# EasyEDA Pro project 天猛星转LITO.eprj

# Schematic Schematic1
Board Name: Board1; Create Date: 2025-07-26; Page Name: P1; Project Name: 天猛星转LITO; Schematic Name: Schematic1; Update Date: 2025-07-26; Company: 嘉立创EDA; Page Size: A4; Version: V1.0
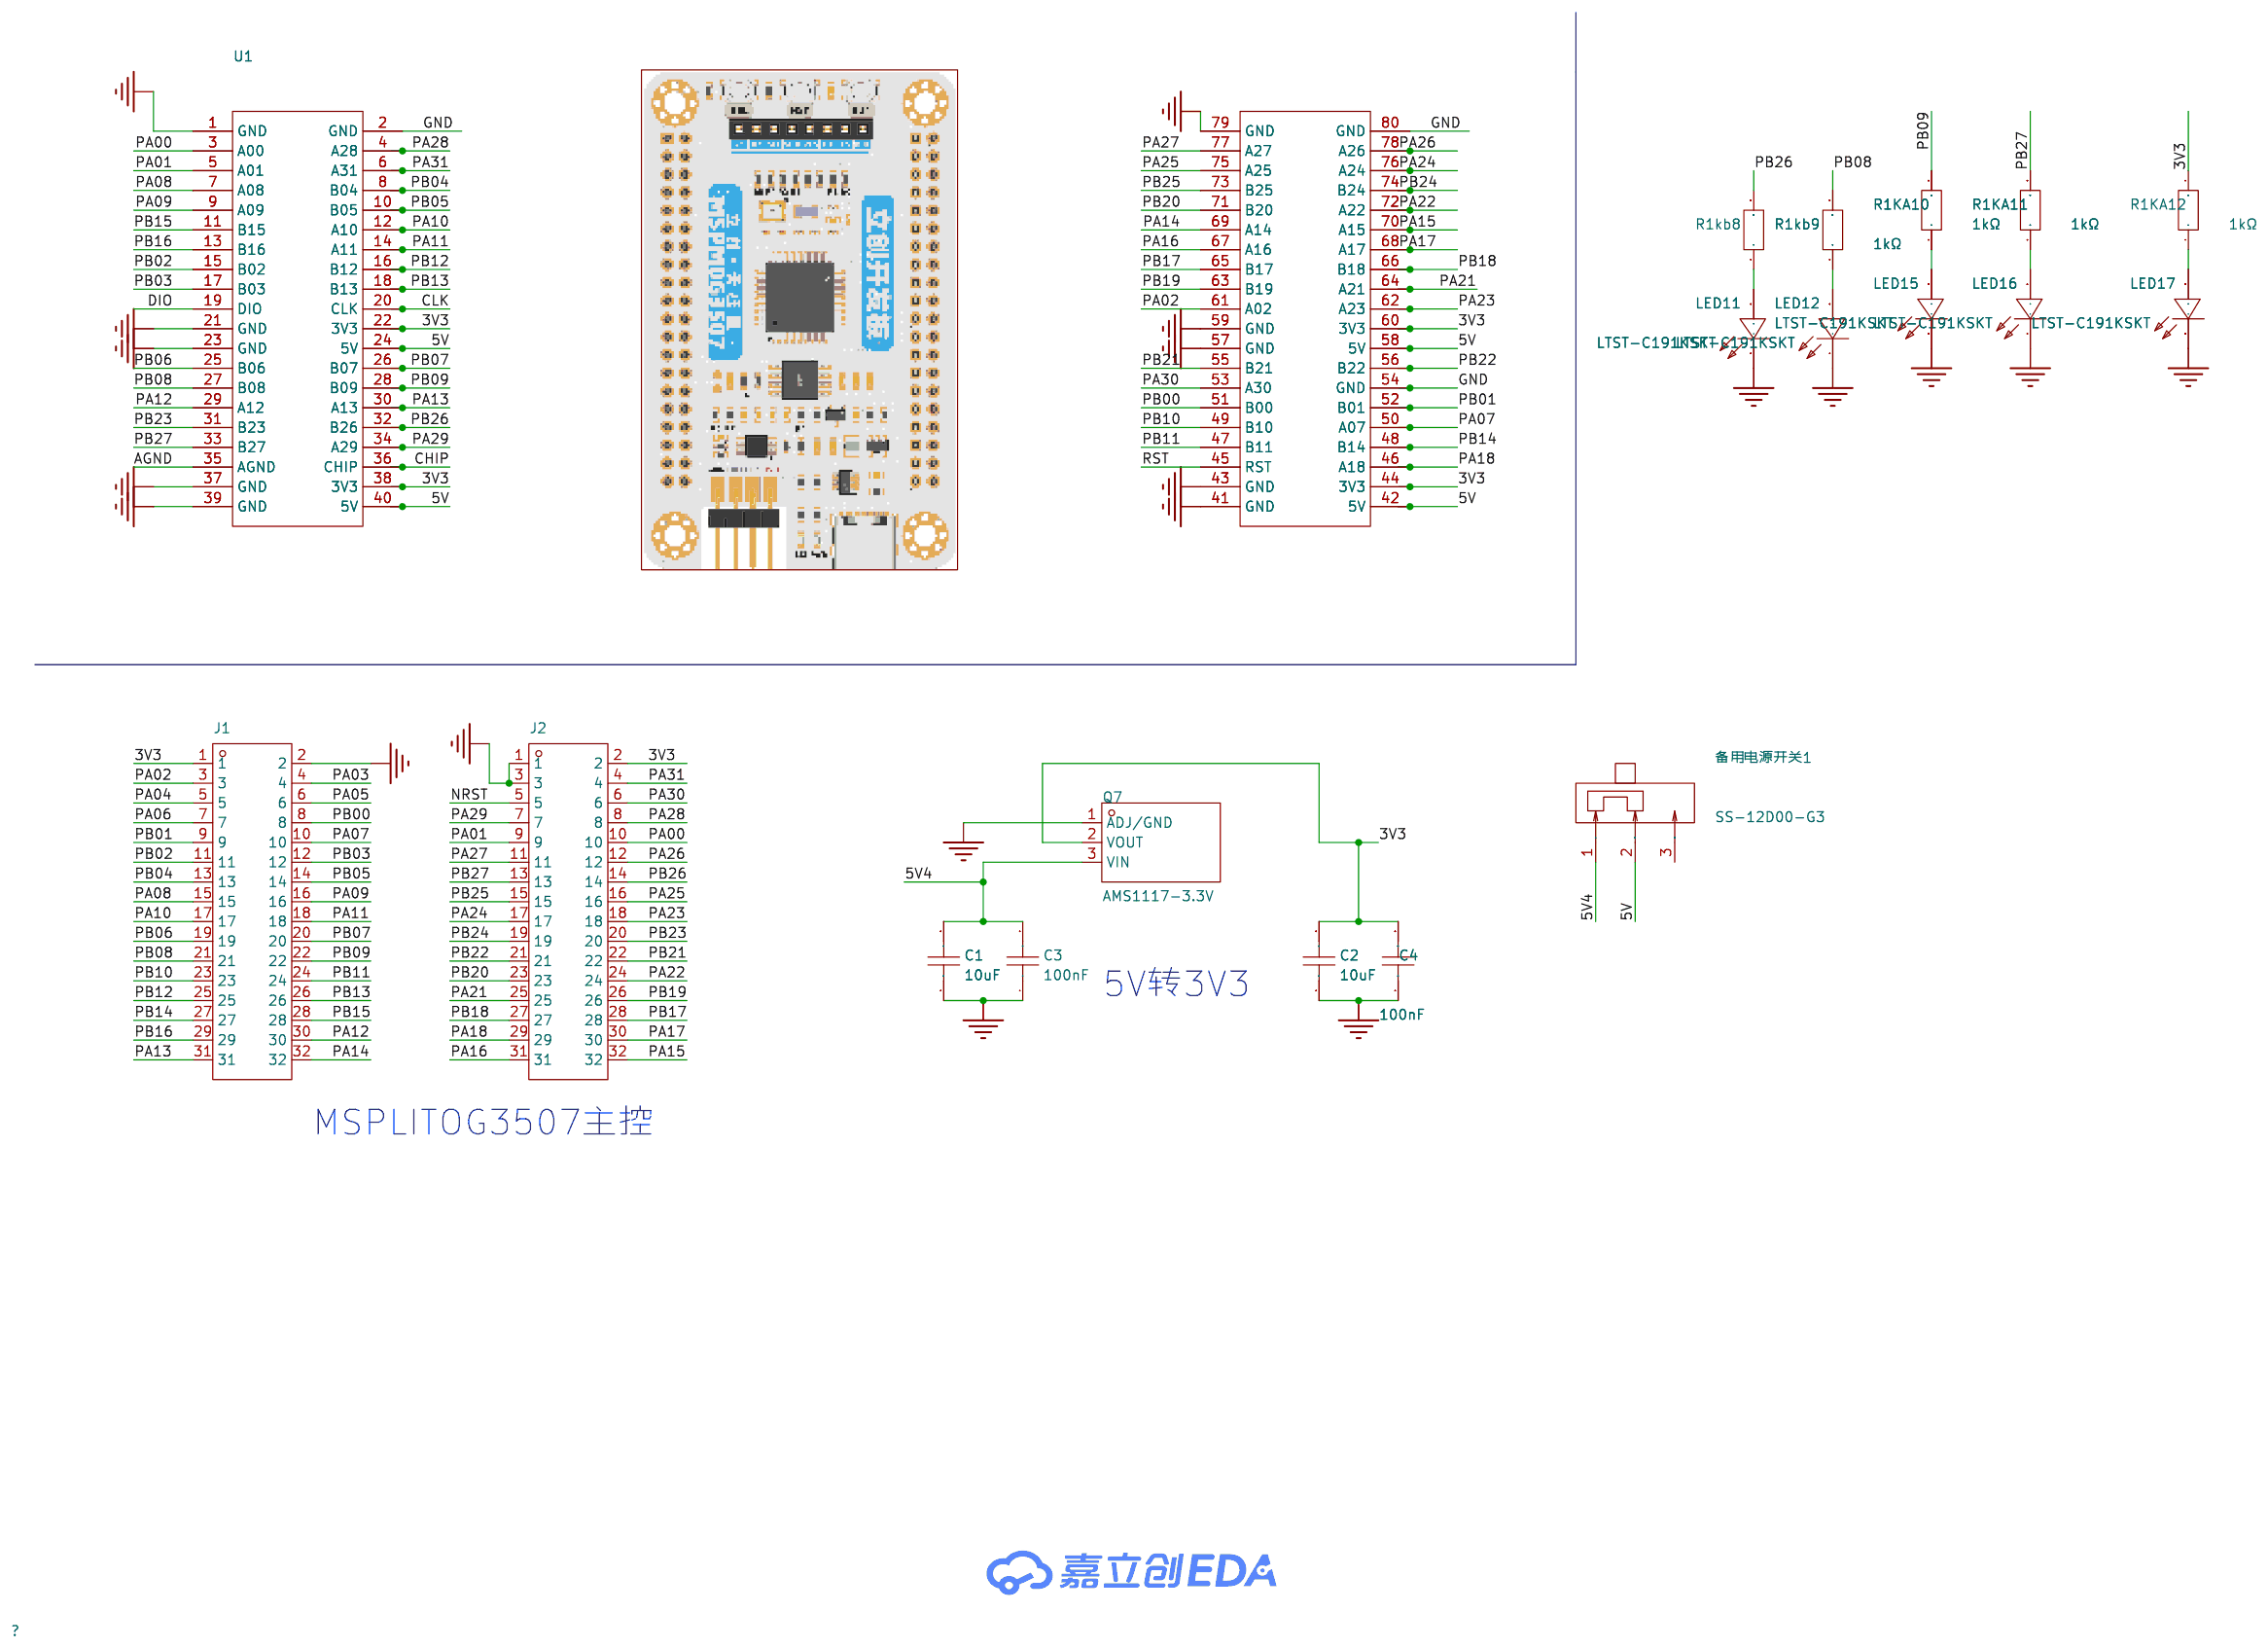
[diagram p0: schematic sheet]

## Parts
C1  10uF  [C0805]
C2  10uF  [C0805]
C3  100nF  [C0603]
C4  100nF  [C0603]
J1  X6521FV-2x16-C85D32  [HDR-TH_32P-P2.54-V-F-R2-C16-S2.54]
J2  X6521FV-2x16-C85D32  [HDR-TH_32P-P2.54-V-F-R2-C16-S2.54]
LED11  LTST-C191KSKT  [LED0603-RD-YELLOW]
LED12  LTST-C191KSKT  [LED0603-RD-YELLOW]
LED15  LTST-C191KSKT  [LED0603-RD-YELLOW]
LED16  LTST-C191KSKT  [LED0603-RD-YELLOW]
LED17  LTST-C191KSKT  [LED0603-RD-YELLOW]
Q7  AMS1117-3.3V  [SOT-89-3_L4.5-W2.5-P1.50-LS4.2-BR]
R1KA10  1kΩ  [R0603]
R1KA11  1kΩ  [R0603]
R1KA12  1kΩ  [R0603]
R1kb8  1kΩ  [R0603]
R1kb9  1kΩ  [R0603]
U1  LCKFB-TMX-MSPM0G3507  [COMM-TH_LCKFB-TMX-MSPM0G3507]
备用电源开关1  SS-12D00-G3  [SW-TH_3P-L8.8-W3.9-P2.50_SS12D00G3]

## Library data of the parts
C1 C2 = CGA0805X5R106K250MT: 容值:10uF;精度:±10%;额定电压:25V;温度系数:X5R;; LCSC Part Name: 10uF ±10% 25V; Supplier Part: C6119887; Manufacturer: HRE(芯声); Supplier Footprint: 0805; JLCPCB Part Class: 扩展库; Supplier: LCSC; Tolerance: ±10%; Voltage Rating: 25V; Temperature Coefficient: X5R
C3 C4 = CGA0603X7R104K500JT: 容值:100nF;精度:±10%;额定电压:50V;温度系数:X7R;; LCSC Part Name: 100nF ±10% 50V; Supplier Part: C6119867; Manufacturer: HRE(芯声); Supplier Footprint: 0603; JLCPCB Part Class: 扩展库; Datasheet: https://atta.szlcsc.com/upload/public/pdf/source/20250103/C44077DA9E7B3EFAE02F22B6D3D1CBC9.pdf; Supplier: LCSC; Tolerance: ±10%; Voltage Rating: 50V; Temperature Coefficient: X7R
J1 J2 = X6521FV-2x16-C85D32: 插孔结构:2x16P;间距:2.54mm;行距:2.54mm;圆孔/方孔:方孔;安装类型:直插;排数:双排;总孔位数:32P;额定电流:3A;额定电压:250V;插孔方向:顶部;塑高:8.5mm;触头材质:黄铜;触头镀层:金;工作温度范围:-40℃~+105℃;焊接温度(最大值):260℃;; LCSC Part Name: 间距:2.54mm 2x16P 直插; Supplier Part: C2883989; Manufacturer: XKB Connection(中国星坤); Supplier Footprint: 插件,P=2.54mm; JLCPCB Part Class: 扩展库; Datasheet: https://atta.szlcsc.com/upload/public/pdf/source/20211009/C636DBF0733662F7F428F4420CCBBD46.pdf; Supplier: LCSC; Holes Structure: 2x16P; Pitch: 2.54mm; Row Spacing: 2.54mm; Circular Hole / Square Hole: 方孔; Mounting Type: 直插; Number of Rows: 双排; Number of Holes: 32P; Current Rating (Max): 3A; Voltage Rating (Max): 250V; Holes Direction: 顶部; Insulation Height: 8.5mm; Contact Material: 黄铜; Contact Plating: 金; Operating Temperature Range: -40℃~+105℃; Soldering Temperature(Max): 260℃
LED11 LED12 LED15-LED17 = LTST-C191KSKT: 发光颜色:黄色;正向电压(VF):2.1V;功率:75mW;正向电流:20mA;主波长:584.5nm~597nm;二极管配置:-;透镜颜色:无色透明透镜;色温:-;发光强度:104mcd;发光角度:130°;载带方式:-;工作温度:-55℃~+85℃;; LCSC Part Name: 黄灯; Supplier Part: C125100; Manufacturer: LITEON(光宝); Supplier Footprint: 0603; JLCPCB Part Class: 扩展库; Datasheet: https://atta.szlcsc.com/upload/public/pdf/source/20180129/C125100_15171877314981315871.pdf; Supplier: LCSC; Emitted Color: 黄色; Forward Voltage (VF): 2.1V; Power Dissipation: 75mW; Forward Current: 20mA; Dominant Wavelength: 584.5nm~597nm; Peak Wavelength: 588nm; Lens Color: 无色透明透镜; Luminous Intensity: 104mcd; Viewing Angle: 130°; Operating Temperature: -55℃~+85℃
Q7 = AMS1117-3.3V_C5120796: 输出类型:固定;工作电压:18V;输出电压:3.3V;输出电流:1A;输出极性:正极;; LCSC Part Name: 输入18V 输出3.3V 1A; Supplier Part: C5120796; Manufacturer: MSKSEMI(美森科); Supplier Footprint: SOT-89; JLCPCB Part Class: 扩展库; Datasheet: https://atta.szlcsc.com/upload/public/pdf/source/20240731/7960C38D2F7D4AC8FF3CFA386029A4C5.pdf; Supplier: LCSC; Output Type: 固定; Voltage - Supply: 18V; Output Voltage: 3.3V; Output Current: 1A; Voltage Dropout: 1.4V@(1A); standby current: 12mA; Operating Temperature: 0℃~+125℃; Output Configuration: 正极; Number of Outputs: 1
R1KA10-R1KA12 R1kb8 R1kb9 = FCR0603F1K: 电阻类型:厚膜电阻;阻值:1kΩ;精度:±1%;功率:100mW;最大工作电压:75V;; LCSC Part Name: 1K ±1%; Supplier Part: C5913168; Manufacturer: VO(翔胜); Supplier Footprint: 0603; JLCPCB Part Class: 扩展库; Datasheet: https://atta.szlcsc.com/upload/public/pdf/source/20230428/98B65D379E9BA4CF2A9223D1647B01B6.pdf; Supplier: LCSC; Type: 厚膜电阻; Tolerance: ±1%; Power(Watts): 100mW; Overload Voltage (Max): 75V; Operating Temperature Range: -55℃~+155℃
U1 = LCKFB-TMX-MSPM0G3507: LCSC Part Name: 5件套 立创·天猛星MSPM0G3507开发板; Supplier Part: C42378531; Manufacturer: 立创开发板; Datasheet: https://atta.szlcsc.com/upload/public/pdf/source/20241209/800332349277522348D9357AB5109808.pdf; Supplier: LCSC
备用电源开关1 = SS-12D00-G3: 操作正拨 插件立式 尺寸大型 两档位; Supplier Part: C22355741; Manufacturer: SOFNG(硕方); Supplier Footprint: 插件-3P,8.8x3.9mm; JLCPCB Part Class: 扩展库; Datasheet: https://atta.szlcsc.com/upload/public/pdf/source/20240529/1037A069FE9BBCECE56007AB916D4384.pdf; Supplier: LCSC

## Nets
3V3: C2.2 C4.2 J1.1 J2.2 Q7.2(VOUT) R1KA12.2 U1.22(3V3) U1.38(3V3) U1.44(3V3) U1.60(3V3)
5V: U1.24(5V) U1.40(5V) U1.42(5V) U1.58(5V) 备用电源开关1.2
5V4: C1.2 C3.2 Q7.3(VIN) 备用电源开关1.1
AGND: U1.35(AGND)
GND: C1.1 C2.1 C3.1 C4.1 J1.2 J2.1 J2.3 LED11.1(-) LED12.1(-) LED15.1(-) LED16.1(-) LED17.1(-) Q7.1(ADJ/GND) U1.1(GND) U1.2(GND) U1.21(GND) U1.23(GND) U1.37(GND) U1.39(GND) U1.41(GND) U1.43(GND) U1.54(GND) U1.57(GND) U1.59(GND) U1.79(GND) U1.80(GND)
CHIP: U1.36(CHIP)
CLK: U1.20(CLK)
DIO: U1.19(DIO)
NRST: J2.5
PA00: J2.10 U1.3(A00)
PA01: J2.9 U1.5(A01)
PA02: J1.3 U1.61(A02)
PA03: J1.4
PA04: J1.5
PA05: J1.6
PA06: J1.7
PA07: J1.10 U1.50(A07)
PA08: J1.15 U1.7(A08)
PA09: J1.16 U1.9(A09)
PA10: J1.17 U1.12(A10)
PA11: J1.18 U1.14(A11)
PA12: J1.30 U1.29(A12)
PA13: J1.31 U1.30(A13)
PA14: J1.32 U1.69(A14)
PA15: J2.32 U1.70(A15)
PA16: J2.31 U1.67(A16)
PA17: J2.30 U1.68(A17)
PA18: J2.29 U1.46(A18)
PA21: J2.25 U1.64(A21)
PA22: J2.24 U1.72(A22)
PA23: J2.18 U1.62(A23)
PA24: J2.17 U1.76(A24)
PA25: J2.16 U1.75(A25)
PA26: J2.12 U1.78(A26)
PA27: J2.11 U1.77(A27)
PA28: J2.8 U1.4(A28)
PA29: J2.7 U1.34(A29)
PA30: J2.6 U1.53(A30)
PA31: J2.4 U1.6(A31)
PB00: J1.8 U1.51(B00)
PB01: J1.9 U1.52(B01)
PB02: J1.11 U1.15(B02)
PB03: J1.12 U1.17(B03)
PB04: J1.13 U1.8(B04)
PB05: J1.14 U1.10(B05)
PB06: J1.19 U1.25(B06)
PB07: J1.20 U1.26(B07)
PB08: J1.21 R1kb9.2 U1.27(B08)
PB09: J1.22 R1KA10.2 U1.28(B09)
PB10: J1.23 U1.49(B10)
PB11: J1.24 U1.47(B11)
PB12: J1.25 U1.16(B12)
PB13: J1.26 U1.18(B13)
PB14: J1.27 U1.48(B14)
PB15: J1.28 U1.11(B15)
PB16: J1.29 U1.13(B16)
PB17: J2.28 U1.65(B17)
PB18: J2.27 U1.66(B18)
PB19: J2.26 U1.63(B19)
PB20: J2.23 U1.71(B20)
PB21: J2.22 U1.55(B21)
PB22: J2.21 U1.56(B22)
PB23: J2.20 U1.31(B23)
PB24: J2.19 U1.74(B24)
PB25: J2.15 U1.73(B25)
PB26: J2.14 R1kb8.2 U1.32(B26)
PB27: J2.13 R1KA11.2 U1.33(B27)
RST: U1.45(RST)
$1N2178: LED17.2(+) R1KA12.1
Net-(LED11-2): LED11.2(+) R1kb8.1
Net-(LED12-2): LED12.2(+) R1kb9.1
Net-(LED15-2): LED15.2(+) R1KA10.1
Net-(LED16-2): LED16.2(+) R1KA11.1

Not connected (* = marked no-connect by the designer): 备用电源开关1 3

## Notes on the sheet
- 5V转3V3
- MSPLITOG3507主控

# Board PCB1
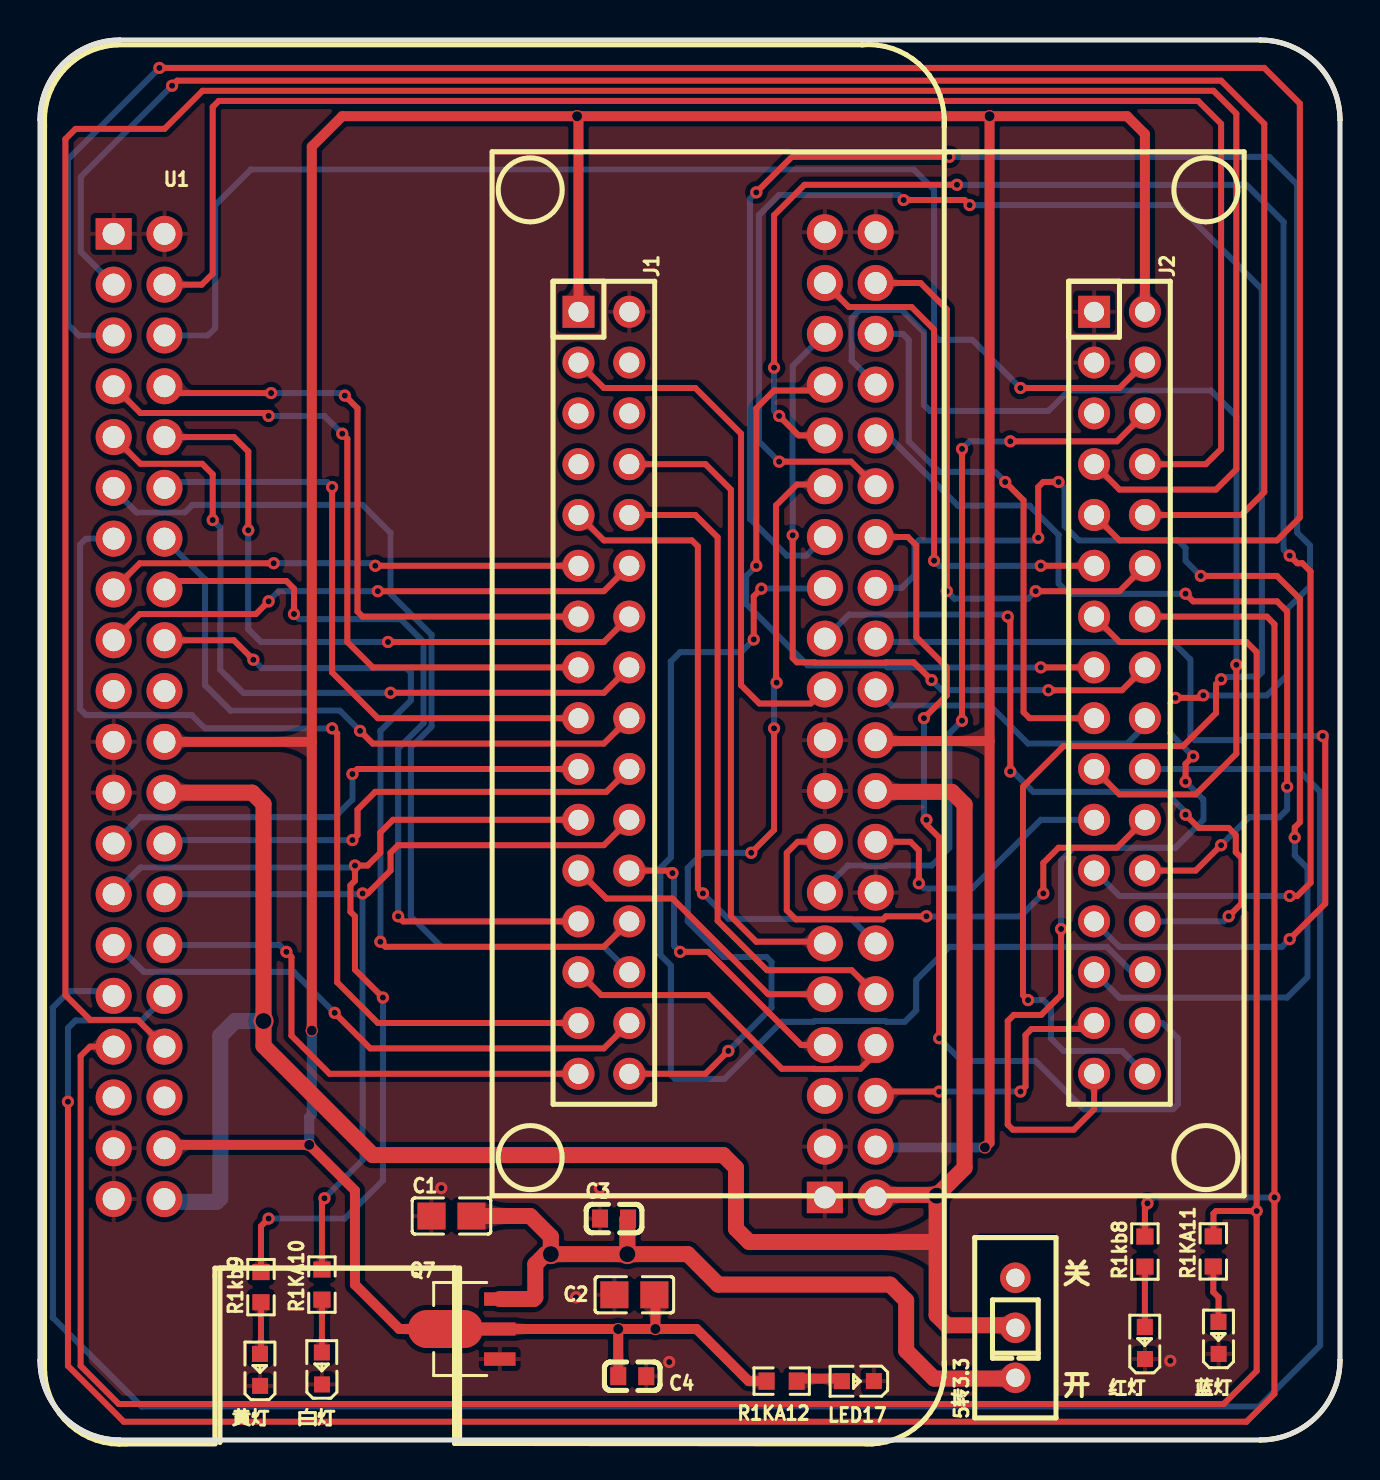
[diagram p1: board, top side]
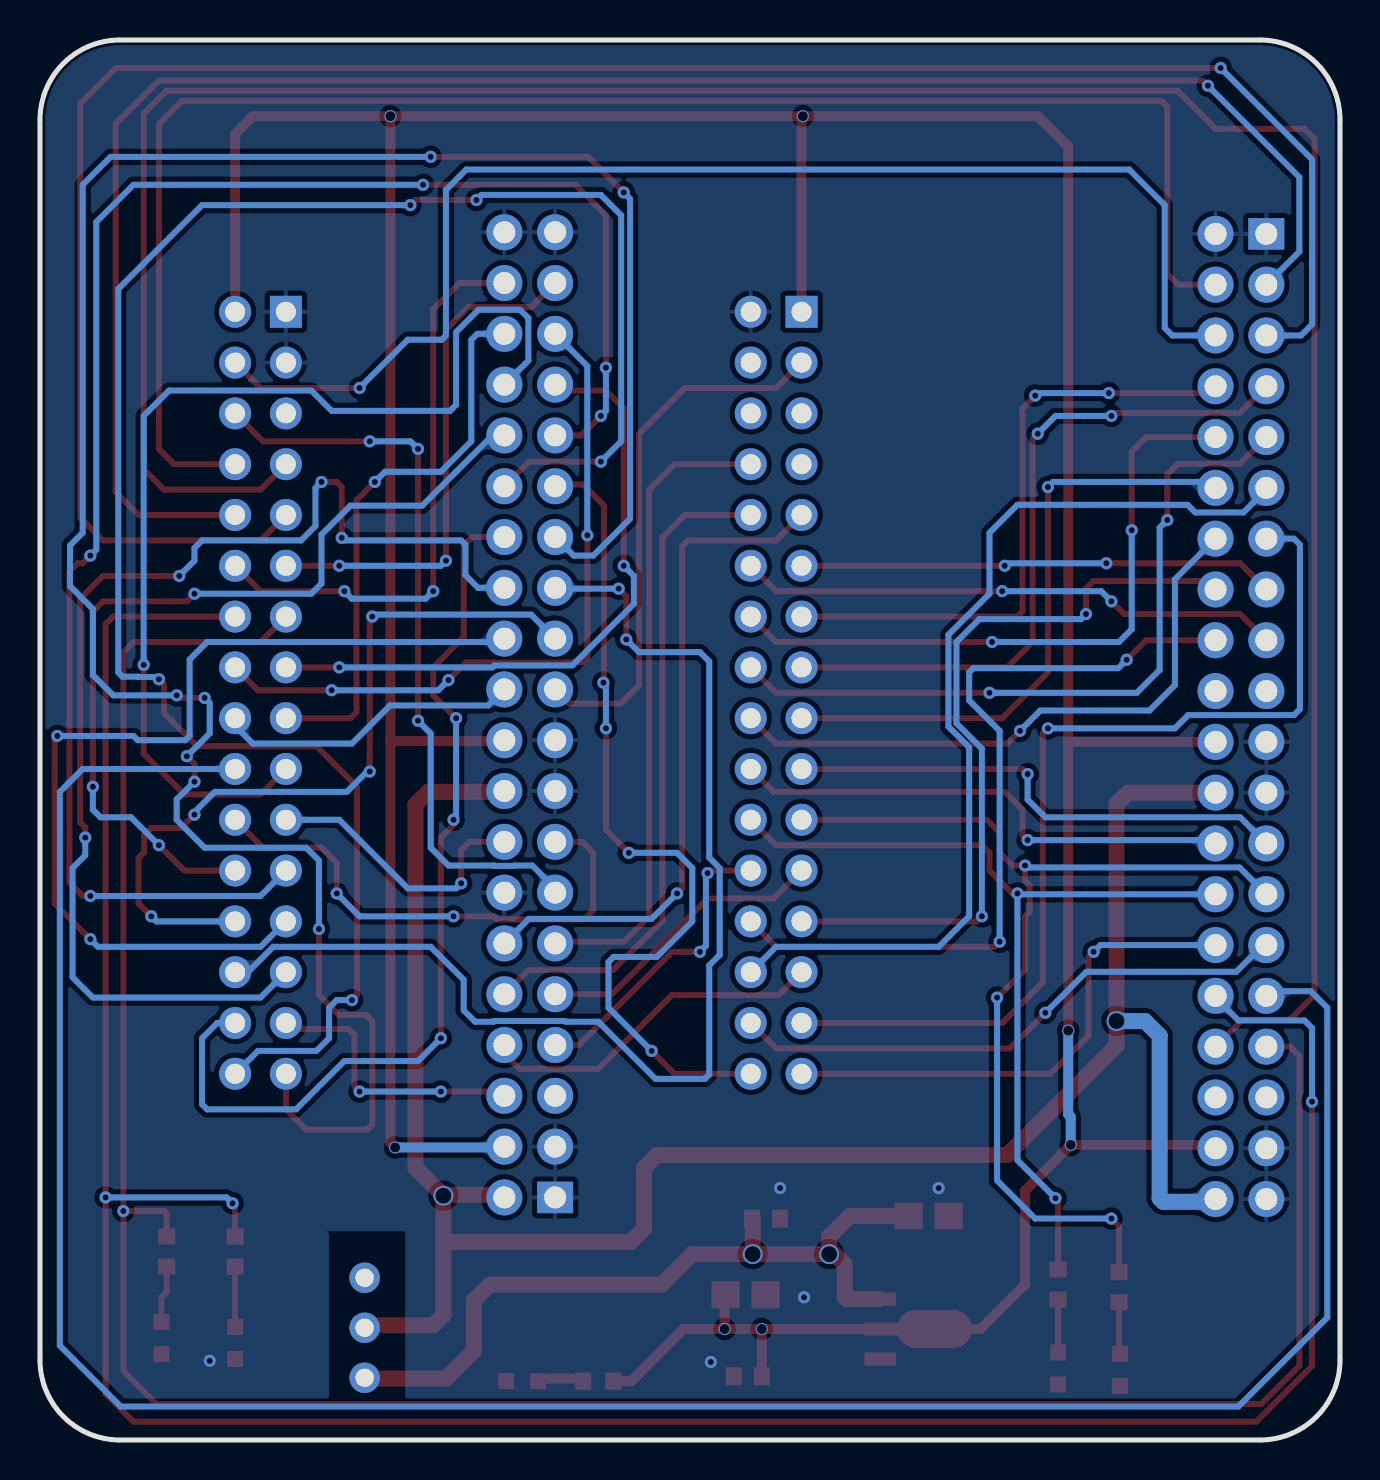
[diagram p2: board, bottom side, seen from below]

Outline 65 x 70 mm; copper layers: Top Layer, Inner1, Inner2, Bottom Layer. Coordinates in mm from the lower left corner of the outline.
Outline path: 0,66 0,4 arc(1.17,1.17) 4,0 61,0 arc(63.83,1.17) 65,4 65,66 arc(63.83,68.83) 61,70 4,70 arc(1.17,68.83) 0,66
Stack: Top Layer 0.035mm 外层铜厚1oz / Dielectric1 0.2104mm 7628 RC49% 8.6mil / Inner1 0.0152mm 内层铜厚 / Dielectric2 1.065mm 1.1mm H/HOZ Copper / Inner2 0.0152mm 内层铜厚 / Dielectric3 0.2104mm 7628 RC49% 8.6mil / Bottom Layer 0.035mm 外层铜厚1oz

## Design rules (mm)
template: 自定义配置
spacing copperThickness1oz (default): track to track 0.102, other pairs 0.152 to 0.3
spacing copperThickness2oz: track to track 0.203, other pairs 0.152 to 0.3
track width copperThickness1oz (default): min 0.3, default 0.3, max 2.54
track width copperThickness2oz: min 0.203, default 0.254, max 2.54
differential pair differentialPair (default): width min 0.127, default 0.254, max 2.54; gap min 0.152, default 0.152
via viaSize (default): diameter min 0.5, default 0.61, max 10; hole min 0.3, default 0.305, max 6.3

## Placement (name value [footprint] x y rotation side)
5转3.3  SS-12D00-G3  [SW-TH_3P-L8.8-W3.9-P2.50_SS12D00G3]  48.77 5.61 90 top
C1  10uF  [C0805]  20.57 11.2 0 top
C2  10uF  [C0805]  29.72 7.26 0 top
C3  100nF  [C0603]  28.7 11.07 0 top
C4  100nF  [C0603]  29.61 3.19 180 top
J1  X6521FV-2x16-C85D32  [HDR-TH_32P-P2.54-V-F-R2-C16-S2.54]  28.19 37.36 270 top
J2  X6521FV-2x16-C85D32  [HDR-TH_32P-P2.54-V-F-R2-C16-S2.54]  53.97 37.36 270 top
LED17  LTST-C191KSKT  [LED0603-RD-YELLOW]  40.89 2.94 180 top
Q7  AMS1117-3.3V  [SOT-89-3_L4.5-W2.5-P1.50-LS4.2-BR]  21.63 5.55 0 top
R1KA10  1kΩ  [R0603]  14.1 7.77 90 top
R1KA11  1kΩ  [R0603]  58.67 9.43 90 top
R1KA12  1kΩ  [R0603]  37.08 2.94 180 top
R1kb8  1kΩ  [R0603]  55.25 9.42 90 top
R1kb9  1kΩ  [R0603]  11.05 7.64 90 top
U1  LCKFB-TMX-MSPM0G3507  [COMM-TH_LCKFB-TMX-MSPM0G3507]  22.73 36.22 0 top
白灯  LTST-C191KSKT  [LED0603-RD-YELLOW]  14.1 3.58 90 top
红灯  LTST-C191KSKT  [LED0603-RD-YELLOW]  55.25 4.85 90 top
蓝灯  LTST-C191KSKT  [LED0603-RD-YELLOW]  58.93 5.1 90 top
黄灯  LTST-C191KSKT  [LED0603-RD-YELLOW]  11 3.5 90 top

## Footprints (pads in the part's own frame, mm; a bottom-side part is the same pattern mirrored in y, then rotated)
C0603
  rect 0.8x0.9 smd: 1(-0.7,0) 2(0.7,0)
C0805
  rect 1.41x1.35 smd: 1(-1,0) 2(1,0)
COMM-TH_LCKFB-TMX-MSPM0G3507
  rect 1.8x1.575 hole 1.1: 1(-19.05,24.09) 41(16.51,-24.09)
  round 1.8 hole 1.1: 2(-16.51,24.09) 3(-19.05,21.549) 4(-16.51,21.549) 5(-19.05,19.009) 6(-16.51,19.009) 7(-19.05,16.47) 8(-16.51,16.47) 9(-19.05,13.93) 10(-16.51,13.93) 11(-19.05,11.389) 12(-16.51,11.389) 13(-19.05,8.85) 14(-16.51,8.85) 15(-19.05,6.309) 16(-16.51,6.309) 17(-19.05,3.769) 18(-16.51,3.769) 19(-19.05,1.23) 20(-16.51,1.23) 21(-19.05,-1.31) 22(-16.51,-1.31) 23(-19.05,-3.85) 24(-16.51,-3.85) 25(-19.05,-6.391) 26(-16.51,-6.391) 27(-19.05,-8.931) 28(-16.51,-8.931) 29(-19.05,-11.47) 30(-16.51,-11.47) 31(-19.05,-14.011) 32(-16.51,-14.011) 33(-19.05,-16.55) 34(-16.51,-16.55) 35(-19.05,-19.09) 36(-16.51,-19.09) 37(-19.05,-21.631) 38(-16.51,-21.631) 39(-19.05,-24.171) 40(-16.51,-24.171) 42(19.05,-24.09) 43(16.51,-21.549) 44(19.05,-21.549) 45(16.51,-19.009) 46(19.05,-19.009) 47(16.51,-16.47) 48(19.05,-16.47) 49(16.51,-13.93) 50(19.05,-13.93) 51(16.51,-11.389) 52(19.05,-11.389) 53(16.51,-8.85) 54(19.05,-8.85) 55(16.51,-6.309) 56(19.05,-6.309) 57(16.51,-3.769) 58(19.05,-3.769) 59(16.51,-1.23) 60(19.05,-1.23) 61(16.51,1.31) 62(19.05,1.31) 63(16.51,3.85) 64(19.05,3.85) 65(16.51,6.391) 66(19.05,6.391) 67(16.51,8.931) 68(19.05,8.931) 69(16.51,11.47) 70(19.05,11.47) 71(16.51,14.011) 72(19.05,14.011) 73(16.51,16.55) 74(19.05,16.55) 75(16.51,19.09) 76(19.05,19.09) 77(16.51,21.631) 78(19.05,21.631) 79(16.51,24.171) 80(19.05,24.171)
HDR-TH_32P-P2.54-V-F-R2-C16-S2.54
  rect 1.6x1.6 hole 1: 1(-19.05,-1.27)
  round 1.6 hole 1: 2(-19.05,1.27) 3(-16.51,-1.27) 4(-16.51,1.27) 5(-13.97,-1.27) 6(-13.97,1.27) 7(-11.43,-1.27) 8(-11.43,1.27) 9(-8.89,-1.27) 10(-8.89,1.27) 11(-6.35,-1.27) 12(-6.35,1.27) 13(-3.81,-1.27) 14(-3.81,1.27) 15(-1.27,-1.27) 16(-1.27,1.27) 17(1.27,-1.27) 18(1.27,1.27) 19(3.81,-1.27) 20(3.81,1.27) 21(6.35,-1.27) 22(6.35,1.27) 23(8.89,-1.27) 24(8.89,1.27) 25(11.43,-1.27) 26(11.43,1.27) 27(13.97,-1.27) 28(13.97,1.27) 29(16.51,-1.27) 30(16.51,1.27) 31(19.05,-1.27) 32(19.05,1.27)
LED0603-RD-YELLOW
  rect 0.8x0.8 smd: 1(-0.799,-0.004) 2(0.799,0.004)
R0603
  rect 0.806x0.864 smd: 1(-0.753,0) 2(0.753,0)
SOT-89-3_L4.5-W2.5-P1.50-LS4.2-BR
  rect 1.575x0.672 smd: 1(1.356,-1.5) 3(1.356,1.5)
  custom 5.377x1.9 smd: 2(-1.356,0)
SW-TH_3P-L8.8-W3.9-P2.50_SS12D00G3
  round 1.524 hole 0.914: 1(-2.5,0) 2(0,0) 3(2.5,0)

## Nets
As in the schematic, except:
5V: 5转3.3.2 U1.24 U1.40 U1.42 U1.58
5V4: 5转3.3.1 C1.2 C3.2 Q7.3
GND: C1.1 C2.1 C3.1 C4.1 J1.2 J2.1 J2.3 LED17.1 Q7.1 U1.1 U1.2 U1.21 U1.23 U1.37 U1.39 U1.41 U1.43 U1.54 U1.57 U1.59 U1.79 U1.80 白灯.1 红灯.1 蓝灯.1 黄灯.1
$1N1641: R1kb8.1 红灯.2
$1N1642: R1kb9.1 黄灯.2
$1N1643: R1KA10.1 白灯.2
$1N1644: R1KA11.1 蓝灯.2

Pads without a net: 5转3.3 3

## Via types
v1: diameter 0.61, hole 0.305, Top Layer to Bottom Layer, 101 vias
v2: diameter 0.61, hole 0.5, Top Layer to Bottom Layer, 7 vias
v3: diameter 1, hole 0.8, Top Layer to Bottom Layer, 4 vias

## Routing (per net, layer and track width the routed paths; a pad name or vN(x,y) marks a point on that pad's centre or on a via; arc(x,y) is an arc through that point)
3V3: length 223.4
  Top Layer w0.5: 13.59,34.91 v2(13.59,20.47) ; 13.59,34.91 13.59,64.67 15.11,66.19 v2(26.86,66.19) ; 13.59,34.91 U1.22 ; J2.2 55.25,65.3 54.36,66.19 v2(47.48,66.19) ; v2(47.48,66.19) 47.48,34.95 ; v2(47.48,66.19) v2(26.86,66.19) ; 47.48,34.95 41.82,34.95 U1.60 ; 47.48,34.95 47.48,14.86 v2(47.24,14.63) ; v2(28.91,5.55) v2(30.77,5.55) ; v2(28.91,5.55) 17.97,5.55 15.75,7.77 15.75,12.47 v2(13.46,14.75) 6.39,14.75 U1.38 ; v2(28.91,5.55) C4.2 ; v2(30.77,5.55) 32.83,5.55 35.43,2.94 R1KA12.2 ; v2(30.77,5.55) 30.77,7.21 C2.2 ; J1.1 26.92,66.12 v2(26.86,66.19)
  Bottom Layer w0.5: v2(13.59,20.47) 13.59,16.28 13.46,16.15 v2(13.46,14.75) ; U1.44 41.82,14.63 v2(47.24,14.63)
5V: length 108.4
  Top Layer w0.8: 44.83,9.9 44.83,6.25 45.34,5.74 48.64,5.74 5转3.3.2 ; 44.83,9.9 35.46,9.9 34.8,10.56 34.8,13.61 34.16,14.25 16.64,14.25 11.18,19.71 v3(11.18,20.95) 11.18,31.8 10.61,32.37 U1.24 ; 44.83,9.9 v3(44.83,12.22) ; U1.58 41.82,32.41 45.59,32.41 46.23,31.77 46.23,13.61 v3(44.83,12.22) ; v3(44.83,12.22) 44.79,12.26 41.91,12.26 U1.42
  Bottom Layer w0.8: U1.40 6.36,11.91 8.84,11.91 9.02,12.09 9.02,20.22 9.75,20.95 v3(11.18,20.95)
5V4: length 38.8
  Top Layer w0.8: v3(29.37,9.29) v3(25.54,9.29) ; v3(29.37,9.29) 29.37,11.04 C3.2 ; v3(29.37,9.29) 32.38,9.29 33.91,7.77 42.51,7.77 43.31,6.97 43.31,4.47 44.7,3.07 48.73,3.07 5转3.3.1 ; v3(25.54,9.29) 25.54,10.17 24.51,11.2 C1.2 ; v3(25.54,9.29) 25.27,9.29 24.76,8.79 24.76,7.13 24.68,7.05 Q7.3
GND:
  vias: v1(20.07,12.6) v1(26.8,7.13) v1(28,12.6) v1(31.46,3.9) v1(56.51,3.96)
PA00: length 93
  Top Layer w0.3: J2.10 60.07,46.25 61.21,47.39 61.21,65.81 59.06,67.97 6.86,67.97 v1(6.6,67.71)
  Bottom Layer w0.3: U1.3 2.03,59.42 2.03,63.14 v1(6.6,67.71)
PA01: length 107
  Top Layer w0.3: v1(5.97,68.6) 61.21,68.6 62.99,66.83 62.99,46.12 61.85,44.98 53.97,44.98 J2.9
  Bottom Layer w0.3: U1.5 1.95,55.23 1.4,55.78 1.4,64.03 v1(5.97,68.6)
PA02: length 27
  Top Layer w0.3: U1.61 38.54,36.83 35.97,36.83 35.05,37.74 35.05,50.31 32.77,52.6 28.19,52.6 J1.3
PA07: length 33.5
  Top Layer w0.3: J1.10 32.77,46.25 33.88,45.14 33.88,25.96 36.35,23.49 40.58,23.49 U1.50
PA08: length 35
  Top Layer w0.3: U1.7 5.02,51.35 11.28,51.35 v1(11.43,51.2) ; v1(15.11,50.31) 15.37,50.06 15.37,39.9 16.64,38.63 J1.15
  Bottom Layer w0.3: v1(15.11,50.31) 14.22,51.2 v1(11.43,51.2)
PA09: length 37.1
  Top Layer w0.3: J1.16 28.19,37.36 v1(17.53,37.36) ; v1(8.64,46) 8.64,48.28 8.11,48.81 5.02,48.81 U1.9
  Bottom Layer w0.3: v1(17.53,37.36) 10.16,37.36 9.02,38.5 9.02,45.62 v1(8.64,46)
PA10: length 31.1
  Top Layer w0.3: J1.17 16.89,36.09 14.6,38.38 v1(14.6,47.65)
  Bottom Layer w0.3: U1.12 6.52,47.9 14.35,47.9 v1(14.6,47.65)
PA11: length 31.1
  Top Layer w0.3: v1(16,35.46) 16.64,34.82 28.19,34.82 J1.18
  Bottom Layer w0.3: v1(16,35.46) 14.99,36.47 9.53,36.47 8.25,37.74 8.25,43.04 U1.14
PA12: length 28.4
  Top Layer w0.3: J1.30 28.19,19.58 16.51,19.58 v1(14.73,21.36)
  Bottom Layer w0.3: U1.29 3.85,24.75 5.19,23.41 12.68,23.41 v1(14.73,21.36)
PA13: length 25.7
  Top Layer w0.3: v1(12.32,24.41) 12.57,24.15 12.57,20.22 14.48,18.31 J1.31
  Bottom Layer w0.3: v1(12.32,24.41) 11.98,24.75 U1.30
PA14: length 42.8
  Top Layer w0.3: v1(36.7,35.58) 36.7,30.5 v1(35.56,29.36) ; U1.69 39.16,47.78 37.85,47.78 36.8,46.73 36.8,37.9 v1(36.83,37.87) ; v1(34.42,19.45) 33.27,18.31 J1.32
  Bottom Layer w0.3: v1(36.83,37.87) 36.7,37.74 v1(36.7,35.58) ; v1(35.56,29.36) 33.15,29.36 32.38,28.6 32.38,25.93 34.16,24.15 36.32,24.15 36.58,23.9 36.58,21.61 v1(34.42,19.45)
PA15: length 99
  Top Layer w0.3: v1(59.06,38.04) 58.8,37.78 58.8,36.34 57.15,34.69 51.18,34.69 49.15,32.66 49.15,22.25 v1(49.4,21.99) ; v1(43.18,62) 46.23,62 v1(46.48,61.75) ; U1.70 40.55,48.92 v1(36.96,48.92)
  Bottom Layer w0.3: v1(36.96,48.92) 35.94,49.93 35.94,61.24 36.96,62.25 42.93,62.25 v1(43.18,62) ; v1(59.06,38.04) 59.06,38.12 59.08,38.15 60.07,38.15 60.08,38.17 60.88,38.17 61.09,38.38 61.09,57.55 56.9,61.75 v1(46.48,61.75) ; v1(49.4,21.99) 50.16,21.99 50.55,21.61 50.55,20.09 51.18,19.45 54.1,19.45 J2.32
PA16: length 117.9
  Top Layer w0.3: v1(57.66,34.19) 57.28,33.81 v1(57.28,32.92) ; v1(35.81,62.38) 37.59,64.16 v1(45.47,64.16) ; J2.31 52.71,16.53 51.69,15.52 48.64,15.52 48.39,15.77 48.39,20.95 48.69,21.25 50.06,21.25 51.05,22.25 v1(51.05,25.55) ; v1(56.77,37.11) 58.04,37.11 v1(58.17,37.23)
  Bottom Layer w0.3: v1(58.17,37.23) 61.34,37.23 62.36,38.25 62.36,41.55 63.5,42.69 63.5,44.73 62.87,45.36 62.87,62.76 61.47,64.16 v1(45.47,64.16) ; v1(35.81,62.38) 35.5,62.06 35.5,46.06 37.34,44.22 38.31,44.22 U1.67 ; v1(57.66,34.19) 56.51,35.33 56.51,36.85 v1(56.77,37.11) ; v1(51.05,25.55) 51.05,28.98 51.69,29.61 56.77,29.61 58.17,31.01 58.17,32.03 v1(57.28,32.92)
PA17: length 47
  Top Layer w0.3: v1(44.2,36.09) 45.34,37.23 45.34,38.63 43.81,40.16 43.81,44.73 43.39,45.15 U1.68 ; v1(44.32,31.01) 44.32,30.76 44.96,30.12 v1(44.96,20.09)
  Bottom Layer w0.3: J2.30 56.13,20.85 56.9,20.09 56.9,16.79 56.64,16.53 52.2,16.53 49.78,18.95 46.1,18.95 v1(44.96,20.09) ; v1(44.2,36.09) 44.2,31.14 v1(44.32,31.01)
PA18: length 13.9
  Top Layer w0.3: v1(49.02,17.42) 49.28,17.68 49.28,20.25 49.58,20.55 52.41,20.55 J2.29 ; v1(44.96,17.42) 42,17.42 U1.46
  Bottom Layer w0.3: v1(49.02,17.42) v1(44.96,17.42)
PA21: length 48.2
  Top Layer w0.3: v1(62.48,25.04) 64.26,26.82 64.26,35.08 v1(64.13,35.2)
  Bottom Layer w0.3: U1.64 41.95,39.9 56.64,39.9 57.52,39.03 57.52,35.2 57.73,34.99 60.11,34.99 60.32,35.2 v1(64.13,35.2) ; J2.25 53.97,24.66 62.1,24.66 v1(62.48,25.04)
PA22: length 43.9
  Top Layer w0.3: v1(57.28,42.31) 57.66,41.93 61.85,41.93 62.36,41.42 v1(62.36,32.66) ; J2.24 57.78,28.47 v1(59.06,29.74)
  Bottom Layer w0.3: v1(59.06,29.74) 60.45,31.14 61.98,31.14 62.36,31.52 v1(62.36,32.66) ; v1(57.28,42.31) 51.44,42.31 50.93,42.82 50.93,45.27 49.48,46.72 45.89,46.72 42.38,50.23 U1.72
PA23: length 15.3
  Bottom Layer w0.3: J2.18 55.25,35.71 54.36,34.82 49.4,34.82 47.5,36.73 42.59,36.73 U1.62
PA24: length 28.1
  Top Layer w0.3: v1(48.26,47.9) 49.18,46.98 49.18,36.39 49.48,36.09 J2.17
  Bottom Layer w0.3: U1.76 43.13,55.31 43.43,55.01 43.43,49.93 44.96,48.41 47.75,48.41 v1(48.26,47.9)
PA25: length 35.6
  Top Layer w0.3: v1(37.63,45.23) 37.63,39.1 37.85,38.89 38.73,38.89 38.75,38.87 42.28,38.87 42.3,38.89 43.69,38.89 v1(44.58,38) ; v1(50.42,37.49) 54.1,37.49 J2.16
  Bottom Layer w0.3: v1(37.63,45.23) 37.63,53.7 U1.75 ; v1(44.58,38) 45.09,37.49 v1(50.42,37.49)
PA26: length 28.9
  Top Layer w0.3: U1.78 44.03,57.85 45.34,56.54 v1(45.34,42.44) ; v1(49.78,42.44) 53.97,42.44 J2.12
  Bottom Layer w0.3: v1(49.78,42.44) 49.41,42.07 45.71,42.07 v1(45.34,42.44)
PA27: length 26.1
  Top Layer w0.3: J2.11 v1(50.04,43.71) ; v1(44.7,43.97) 44.7,55.52 43.58,56.65 40.44,56.65 U1.77
  Bottom Layer w0.3: v1(44.7,43.97) 44.96,43.71 v1(50.04,43.71)
PA28: length 82.4
  Top Layer w0.3: J2.8 58.29,48.79 59.06,49.55 59.06,65.81 57.91,66.95 8.94,66.95 8.64,66.65 8.64,58.32 8.09,57.77 U1.4
PA29: length 134.7
  Top Layer w0.3: U1.34 4.89,21.01 2.51,21.01 1.27,22.25 1.27,65.05 1.78,65.56 6.22,65.56 8.13,67.46 58.67,67.46 59.82,66.32 59.82,48.54 58.8,47.52 53.97,47.52 J2.7
PA30: length 37.4
  Top Layer w0.3: J2.6 53.85,49.93 v1(48.51,49.93) ; v1(46.1,49.55) v1(46.1,35.96)
  Bottom Layer w0.3: U1.53 39.24,27.58 40.39,28.72 41.27,28.72 41.28,28.71 42.28,28.71 42.3,28.72 44.58,28.72 45.47,29.61 45.47,35.33 v1(46.1,35.96) ; v1(48.51,49.93) 46.48,49.93 v1(46.1,49.55)
PA31: length 65.4
  Top Layer w0.3: v1(49.02,52.6) 53.97,52.6 J2.4
  Bottom Layer w0.3: v1(49.02,52.6) 46.61,55.01 44.92,55.01 44.7,55.23 44.7,62.51 43.69,63.52 10.54,63.52 8.76,61.75 8.76,55.6 8.39,55.23 U1.6
PB00: length 32.2
  Top Layer w0.3: J1.8 33.27,48.79 34.54,47.52 34.54,26.19 35.81,24.92 39.16,24.92 U1.51
PB01: length 33.7
  Top Layer w0.3: v1(33.15,27.33) 32.89,27.58 32.89,44.68 32.59,44.98 28.19,44.98 J1.9
  Bottom Layer w0.3: v1(33.15,27.33) 34.42,26.06 40.55,26.06 U1.52
PB02: length 23.8
  Top Layer w0.3: v1(11.68,43.84) 4.99,43.84 U1.15 ; J1.11 v1(16.76,43.71)
  Bottom Layer w0.3: v1(11.68,43.84) 16.64,43.84 v1(16.76,43.71)
PB03: length 27.3
  Top Layer w0.3: J1.12 28.19,42.44 v1(16.89,42.44) ; v1(11.43,41.93) 10.79,41.3 4.99,41.3 U1.17
  Bottom Layer w0.3: v1(11.43,41.93) 11.94,42.44 v1(16.89,42.44)
PB04: length 31.4
  Top Layer w0.3: U1.8 6.56,52.35 v1(11.56,52.35) ; v1(15.24,52.22) 15.88,51.58 15.88,41.42 16.13,41.17 J1.13
  Bottom Layer w0.3: v1(15.24,52.22) 15.11,52.35 v1(11.56,52.35)
PB05: length 33.2
  Top Layer w0.3: v1(17.4,39.9) 28.19,39.9 J1.14 ; U1.10 9.69,50.15 10.41,49.43 v1(10.41,45.49)
  Bottom Layer w0.3: v1(10.41,45.49) 10.41,40.54 11.05,39.9 v1(17.4,39.9)
PB06: length 25.5
  Top Layer w0.3: v1(15.62,33.3) 15.88,33.55 J1.19
  Bottom Layer w0.3: U1.25 4.99,31.14 14.73,31.14 15.62,32.03 v1(15.62,33.3)
PB07: length 25.5
  Top Layer w0.3: v1(15.62,30) 15.88,30.25 15.88,31.52 16.76,32.41 28.32,32.41 J1.20
  Bottom Layer w0.3: v1(15.62,30) 6.39,30 U1.26
PB08: length 51.2
  Top Layer w0.3: v1(11.43,11.07) 11.05,10.69 R1kb9.2 ; v1(17.15,22.12) 15.75,23.52 15.75,26.19 15.52,26.41 15.52,27.74 15.75,27.96 v1(15.75,28.72) 16.38,28.72 17.02,29.36 17.02,30.38 17.65,31.01 J1.21
  Bottom Layer w0.3: v1(17.15,22.12) 17.15,12.98 15.24,11.07 v1(11.43,11.07) ; U1.27 5.02,28.63 15.65,28.63 v1(15.75,28.72)
PB09: length 45
  Top Layer w0.3: J1.22 28.19,29.74 17.91,29.74 17.53,29.36 17.53,28.47 16.38,27.33 v1(16.13,27.33) ; R1KA10.2 14.1,11.96 v1(14.22,12.09)
  Bottom Layer w0.3: U1.28 16.09,27.29 v1(16.13,27.33) 16.13,13.99 v1(14.22,12.09)
PB10: length 14.9
  Top Layer w0.3: J1.23 28.32,27.07 31.62,27.07 36.41,22.29 U1.49
PB11: length 15.5
  Top Layer w0.3: J1.24 31.5,28.47 v1(31.62,28.34) ; v1(32,24.41) 33.4,24.41 38.06,19.75 U1.47
  Bottom Layer w0.3: v1(31.62,28.34) 31.7,28.26 31.7,24.71 v1(32,24.41)
PB12: length 38.5
  Top Layer w0.3: v1(12.7,41.3) 12.7,42.57 12.32,42.95 6.64,42.95 U1.16 ; J1.25 18.16,25.93 v1(17.91,26.19)
  Bottom Layer w0.3: v1(12.7,41.3) 12.95,41.04 18.03,41.04 19.18,39.9 19.18,35.84 17.91,34.57 v1(17.91,26.19)
PB13: length 40.2
  Top Layer w0.3: J1.26 28.19,24.66 17.27,24.66 v1(17.02,24.92) ; U1.18 9.69,39.99 v1(10.67,39.01)
  Bottom Layer w0.3: v1(17.02,24.92) 17.02,35.46 18.54,36.98 18.54,38.38 18.33,38.59 11.09,38.59 v1(10.67,39.01)
PB14: length 17.6
  Top Layer w0.3: J1.27 28.07,22.25 33.4,22.25 37.09,18.56 38.73,18.56 38.75,18.55 39.74,18.55 39.75,18.56 41.02,18.56 41.78,19.32 U1.48
PB15: length 47.7
  Bottom Layer w0.3: U1.11 3.68,47.52 4.83,46.38 7.24,46.38 7.62,46.76 16.13,46.76 17.53,45.36 17.53,42.31 19.58,40.26 19.58,35.67 18.54,34.63 18.54,26.19 20.07,24.66 28.19,24.66 J1.28
PB16: length 48.7
  Top Layer w0.3: J1.29 16.89,20.85 14.86,22.88 14.86,35.33 v1(14.6,35.58)
  Bottom Layer w0.3: U1.13 2.3,45.07 2,44.77 2,36.55 2.3,36.25 7.59,36.25 8.25,35.58 v1(14.6,35.58)
PB17: length 59.6
  Top Layer w0.3: v1(36.07,42.57) 35.69,42.19 v1(35.69,40.03)
  Bottom Layer w0.3: J2.28 54.61,23.39 53.34,24.66 45.47,24.66 43.81,23.01 43.81,21.49 43.24,20.91 42.32,20.91 42.28,20.95 38.75,20.95 38.71,20.91 37.08,20.91 34.23,18.06 31.75,18.06 31.54,18.27 31.54,23.73 31.02,24.25 31.02,28.6 31.54,29.12 31.54,38.93 32,39.39 35.05,39.39 v1(35.69,40.03) ; U1.65 39.2,42.57 v1(36.07,42.57)
PB18: length 60.6
  Top Layer w0.3: v1(49.91,45.11) 49.91,47.65 50.16,47.9 v1(50.93,47.9) ; v1(58.04,43.2) 61.85,43.2 62.99,42.06 62.99,30.88 62.74,30.63 v1(62.74,30.12)
  Bottom Layer w0.3: v1(50.93,47.9) 51.23,47.6 51.23,45.7 51.94,44.98 56.9,44.98 57.28,44.6 57.28,43.97 v1(58.04,43.2) ; v1(49.91,45.11) 49.78,44.98 43.94,44.98 43.73,44.77 43.73,43.25 43.09,42.61 U1.66 ; J2.27 53.97,22.12 62.36,22.12 63.37,23.14 63.37,28.6 62.74,29.23 v1(62.74,30.12)
PB19: length 38.9
  Top Layer w0.3: v1(48.39,41.17) 48.51,41.04 v1(48.51,33.42) ; v1(59.44,26.19) 60.07,26.82 60.07,29.11 59.79,29.39 59.79,30.25 59.43,30.6 57.94,30.6 v1(57.28,31.27)
  Bottom Layer w0.3: v1(48.39,41.17) 48.29,41.27 40.44,41.27 U1.63 ; v1(57.28,31.27) 57.28,31.39 56.26,32.41 49.66,32.41 48.64,33.42 v1(48.51,33.42) ; J2.26 59.18,25.93 v1(59.44,26.19)
PB20: length 85.1
  Top Layer w0.3: v1(62.48,44.22) 62.87,43.84 63.12,43.84 63.53,43.43 63.53,27.86 62.87,27.2 v1(62.48,27.2) ; v1(45.85,62.76) 38.23,62.76 36.7,61.24 v1(36.7,53.62) ; U1.71 37.93,50.23 v1(36.96,51.2)
  Bottom Layer w0.3: v1(45.85,62.76) 60.32,62.76 62.18,60.9 62.18,44.52 v1(62.48,44.22) ; v1(36.96,51.2) 36.7,51.46 v1(36.7,53.62) ; v1(62.48,27.2) 53.97,27.2 J2.23
PB21: length 26.1
  Top Layer w0.3: v1(44.32,26.19) 42.3,26.19 42.15,26.03 37.79,26.03 37.34,26.48 37.34,29.36 37.89,29.91 U1.55 ; v1(50.16,27.33) 50.16,28.85 50.93,29.61 53.85,29.61 J2.22
  Bottom Layer w0.3: v1(50.16,27.33) 49.02,26.19 v1(44.32,26.19)
PB22: length 14.3
  Top Layer w0.3: U1.56 43.52,29.91 43.94,29.49 v1(43.94,27.84)
  Bottom Layer w0.3: v1(43.94,27.84) 44.2,27.58 46.61,27.58 50.04,31.01 J2.21
PB23: length 122.4
  Bottom Layer w0.3: U1.31 3.45,22.44 1.46,22.44 0.64,21.61 0.64,6.12 5.08,1.67 60.96,1.67 64.01,4.72 64.01,32.41 62.87,33.55 J2.20
PB24: length 53.8
  Top Layer w0.3: J2.19 53.97,32.28 57.78,32.28 59.82,34.31 v1(59.82,38.76)
  Bottom Layer w0.3: v1(59.82,38.76) 59.82,51.2 58.55,52.47 51.44,52.47 50.42,51.46 44.5,51.46 44.2,51.76 44.2,55.39 43.08,56.51 40.99,56.51 40.58,56.1 40.58,53.97 U1.74
PB25: length 32.6
  Top Layer w0.3: v1(35.81,43.71) 35.81,51.58 36.7,52.47 38.95,52.47 U1.73 ; J2.15 v1(50.04,38.63)
  Bottom Layer w0.3: v1(35.81,43.71) 35.31,43.2 35.31,41.81 38.38,38.73 42.28,38.73 42.38,38.63 v1(50.04,38.63)
PB26: length 137.8
  Top Layer w0.3: J2.14 61.34,41.17 61.72,40.79 v1(61.72,12.13) 61.72,2.31 60.32,0.91 4.19,0.91 1.4,3.71 v1(1.4,16.91) ; v1(55.37,11.83) 55.25,11.71 R1kb8.2
  Bottom Layer w0.3: v1(55.37,11.83) 55.67,12.13 v1(61.72,12.13) ; v1(1.4,16.91) 1.4,20.6 1.78,20.98 5.08,20.98 6.22,22.12 U1.32
PB27: length 125.8
  Top Layer w0.3: v1(60.83,11.45) 58.8,11.45 58.67,11.33 58.67,10.19 R1KA11.2 ; v1(60.83,11.45) 60.83,39.39 60.32,39.9 53.97,39.9 J2.13 ; v1(60.83,11.45) 60.83,3.45 59.18,1.8 3.94,1.8 2.03,3.71 2.03,19.2 2.5,19.67 U1.33
$1N1641: length 3
  Top Layer w0.3: 红灯.2 55.25,5.65 R1kb8.1
$1N1642: length 2.6
  Top Layer w0.3: R1kb9.1 11.05,4.35 黄灯.2
$1N1643: length 2.6
  Top Layer w0.3: 白灯.2 14.1,4.38 R1KA10.1
$1N1644: length 2.9
  Top Layer w0.3: R1KA11.1 58.67,7.4 58.93,7.13 58.93,5.91 蓝灯.2
$1N2178: length 2.3
  Top Layer w0.5: R1KA12.1 37.96,3.07 40.09,3.07

## Copper pours and planes (outline as drawn; the poured copper is in the pictures)
GND on Top Layer: -8,73.56 63.37,73.56 69.09,67.84 67.56,64.41 66.42,1.8 64.12,-0.74 51.82,-0.74 50.92,0.16 50.8,0.16 50.8,10.33 46.95,10.33 46.74,10.12 46.74,0.4 46.48,0.15 46.48,-1.37 45.59,-2.26 -3.56,-2.26 -5.46,-0.36 -5.46,71.02
GND on Bottom Layer: -2.29,74.44 61.21,74.44 69.98,65.68 69.98,-4.29 53.09,-4.29 50.55,-1.75 50.55,10.31 50.67,10.44 46.74,10.44 46.74,-1.53 46.48,-1.78 -0.15,-1.78 -2.67,-4.29 -2.67,73.81 -2.29,74.19
GND on Inner2: -1.4,0.66 -1.4,71.4 66.8,71.4 68.96,69.24 68.96,-1.25 69.09,-1.37 52.58,-1.37 50.93,0.28 50.93,10.18 50.67,10.44 47.19,10.44 46.87,10.12 46.87,0.29 43.43,-3.15 2.41,-3.15

Small or netless copper shapes (teardrops, artwork), in the pictures only: 223 on Top Layer, 137 on Bottom Layer, 1 on Inner2

## Text on the board
Top Silkscreen Layer: 关 | 开

# Board PCB2
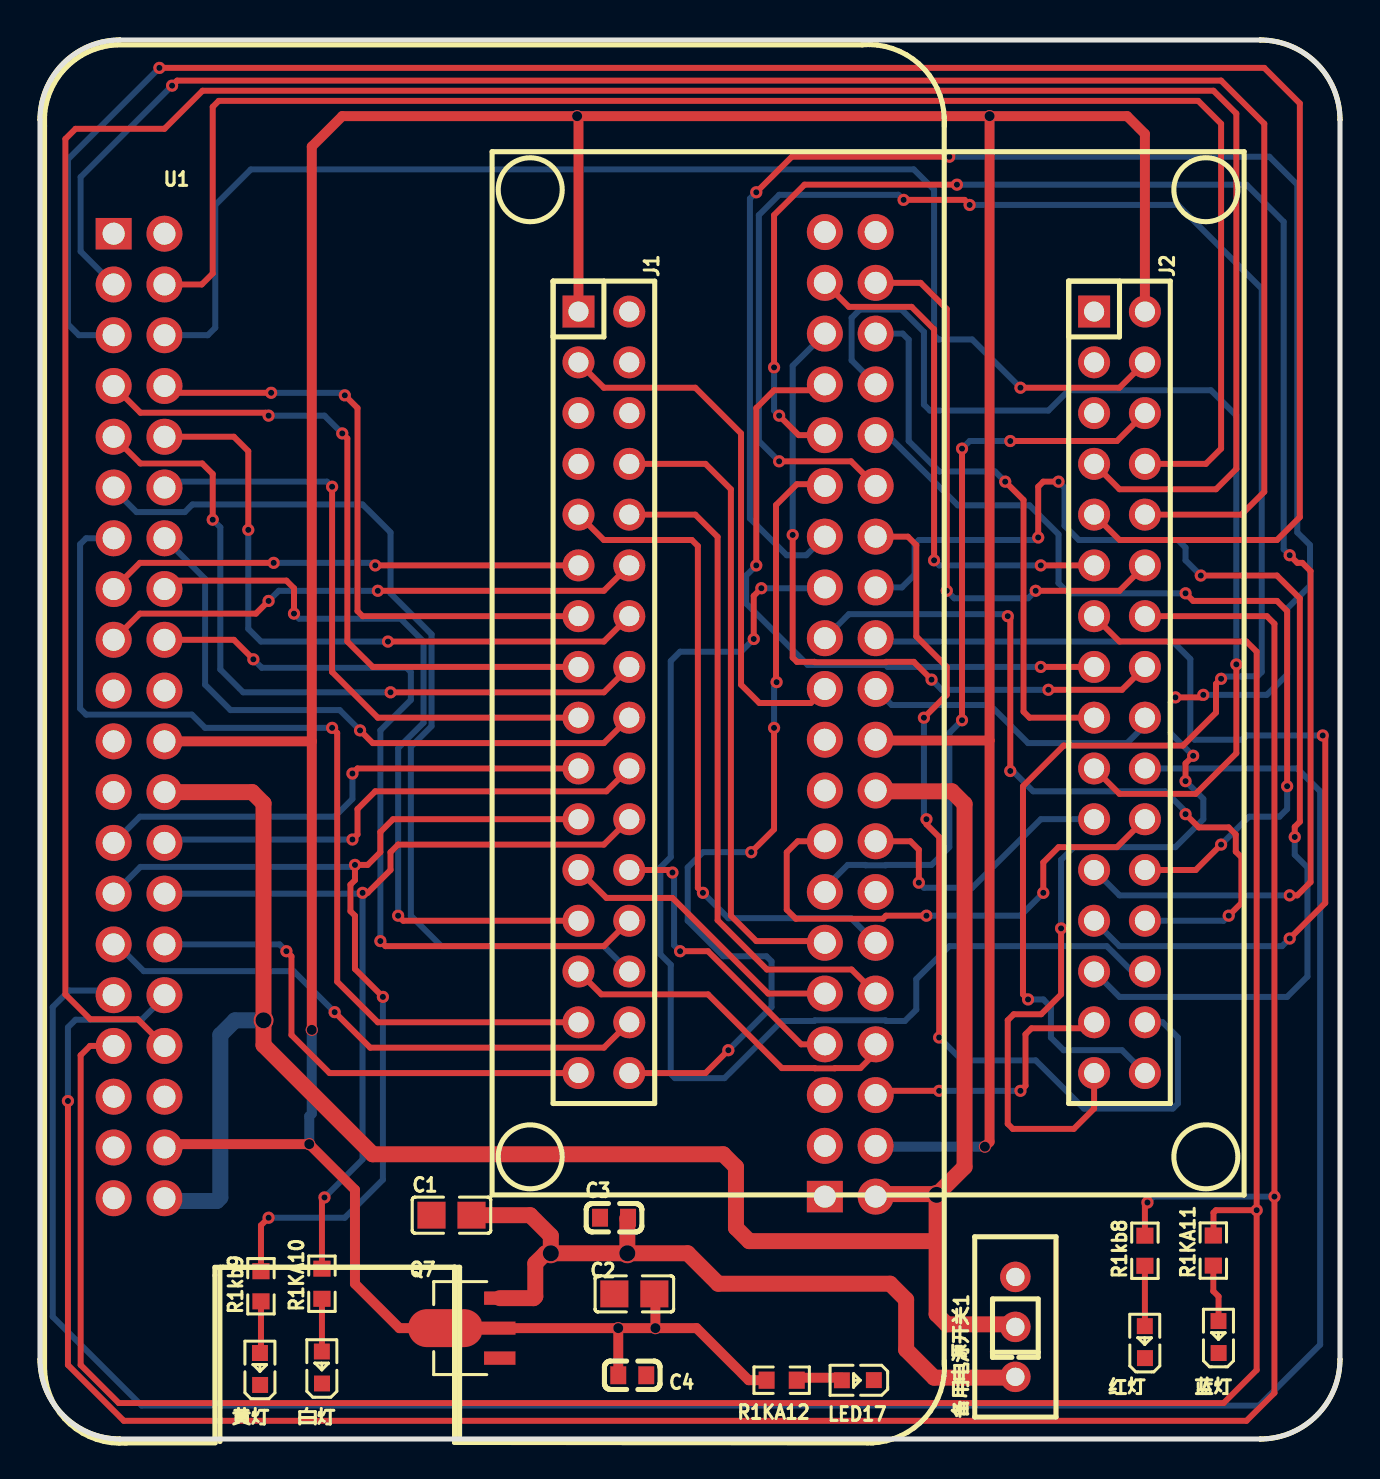
[diagram p3: board, top side]
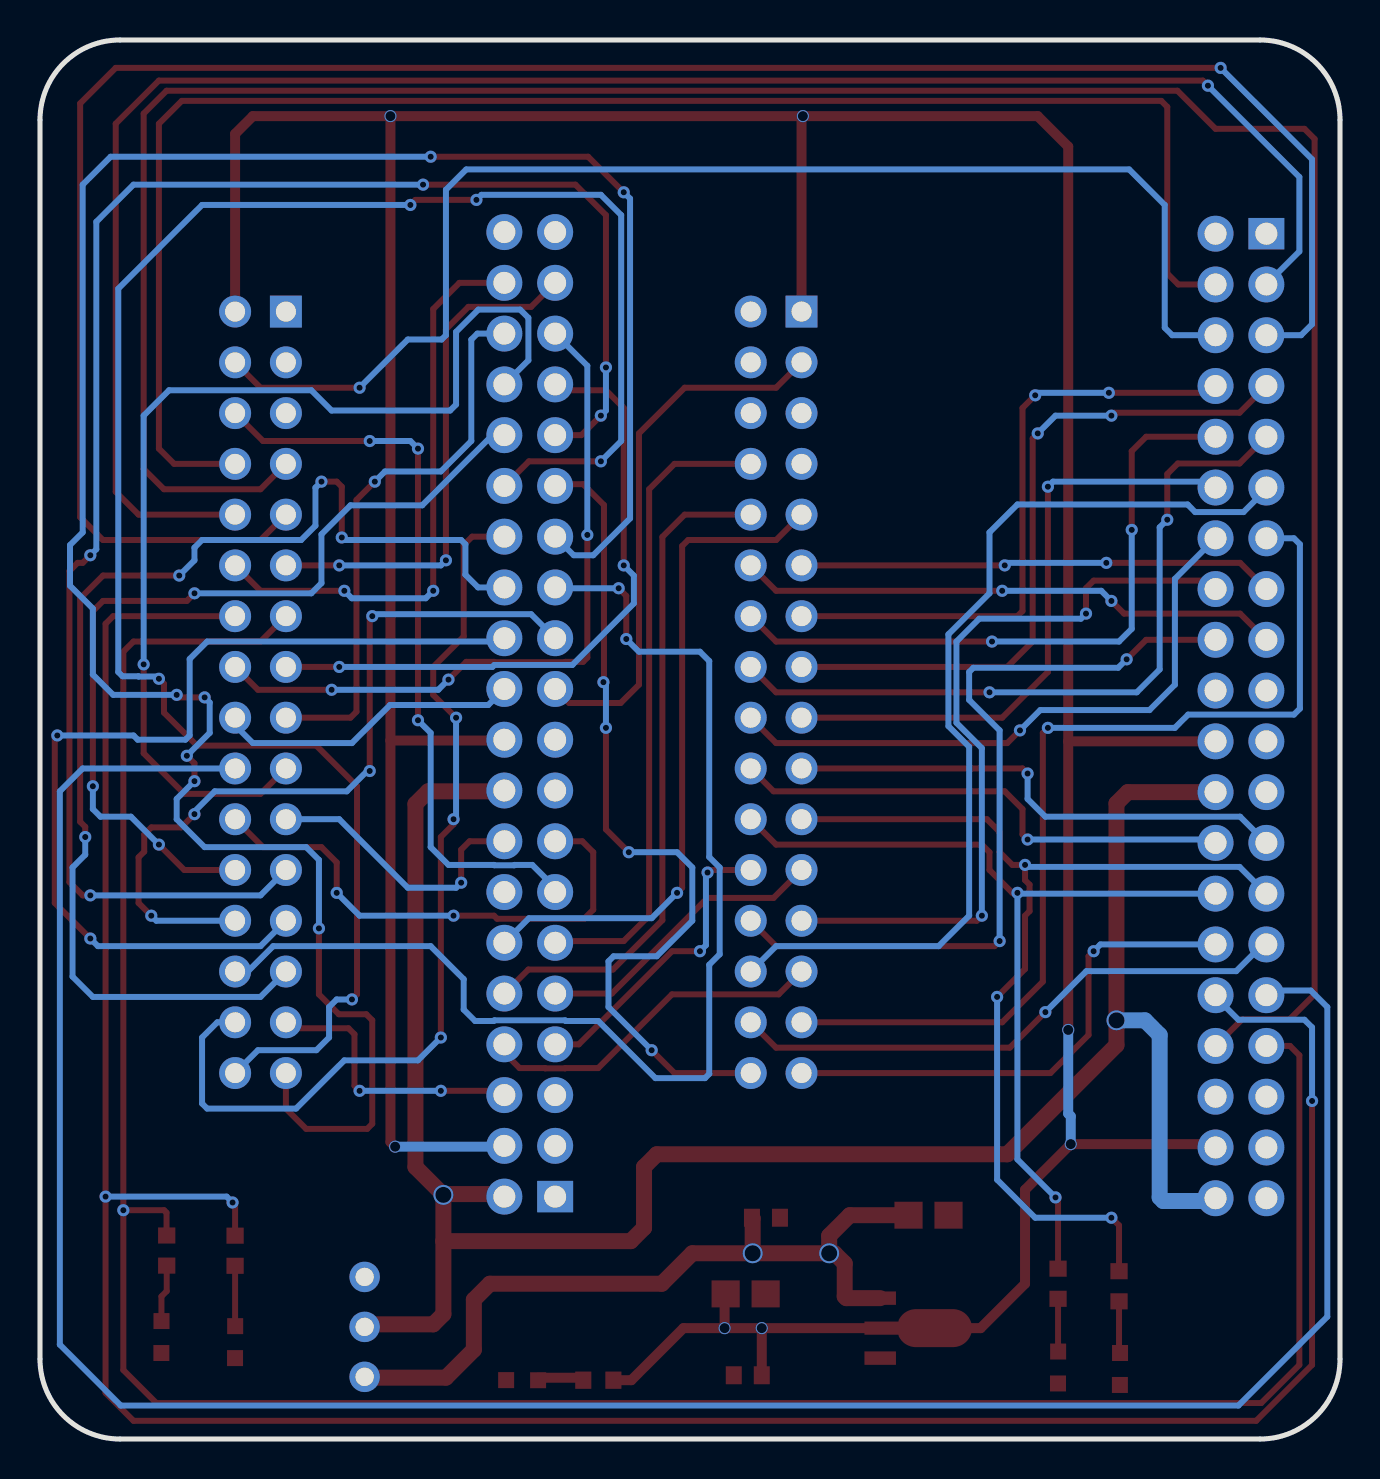
[diagram p4: board, bottom side, seen from below]

Outline 65 x 70 mm; copper layers: Top Layer, Bottom Layer. Coordinates in mm from the lower left corner of the outline.
Outline path: 0,66 0,4 arc(1.17,1.17) 4,0 61,0 arc(63.83,1.17) 65,4 65,66 arc(63.83,68.83) 61,70 4,70 arc(1.17,68.83) 0,66
Stack: Top Layer 0.035mm / Dielectric1 1.51mm FR4 er 4.5 / Bottom Layer 0.035mm

## Design rules (mm)
template: JLCPCB Capability(Two Layers Board)
spacing copperThickness1oz (default): track to track 0.102, other pairs 0.152 to 0.3
spacing copperThickness2oz: track to track 0.203, other pairs 0.152 to 0.3
track width copperThickness1oz (default): min 0.127, default 0.254, max 2.54
track width copperThickness2oz: min 0.203, default 0.254, max 2.54
differential pair differentialPair (default): width min 0.127, default 0.254, max 2.54; gap min 0.152, default 0.152
via viaSize (default): diameter min 0.5, default 0.61, max 10; hole min 0.3, default 0.305, max 6.3

## Placement (name value [footprint] x y rotation side)
C1  10uF  [C0805]  20.57 11.2 0 top
C2  10uF  [C0805]  29.72 7.26 0 top
C3  100nF  [C0603]  28.7 11.07 0 top
C4  100nF  [C0603]  29.61 3.19 180 top
J1  X6521FV-2x16-C85D32  [HDR-TH_32P-P2.54-V-F-R2-C16-S2.54]  28.19 37.36 270 top
J2  X6521FV-2x16-C85D32  [HDR-TH_32P-P2.54-V-F-R2-C16-S2.54]  53.97 37.36 270 top
LED17  LTST-C191KSKT  [LED0603-RD-YELLOW]  40.89 2.94 180 top
Q7  AMS1117-3.3V  [SOT-89-3_L4.5-W2.5-P1.50-LS4.2-BR]  21.63 5.55 0 top
R1KA10  1kΩ  [R0603]  14.1 7.77 90 top
R1KA11  1kΩ  [R0603]  58.67 9.43 90 top
R1KA12  1kΩ  [R0603]  37.08 2.94 180 top
R1kb8  1kΩ  [R0603]  55.25 9.42 90 top
R1kb9  1kΩ  [R0603]  11.05 7.64 90 top
U1  LCKFB-TMX-MSPM0G3507  [COMM-TH_LCKFB-TMX-MSPM0G3507]  22.73 36.22 0 top
备用电源开关1  SS-12D00-G3  [SW-TH_3P-L8.8-W3.9-P2.50_SS12D00G3]  48.77 5.61 90 top
白灯  LTST-C191KSKT  [LED0603-RD-YELLOW]  14.1 3.58 90 top
红灯  LTST-C191KSKT  [LED0603-RD-YELLOW]  55.25 4.85 90 top
蓝灯  LTST-C191KSKT  [LED0603-RD-YELLOW]  58.93 5.1 90 top
黄灯  LTST-C191KSKT  [LED0603-RD-YELLOW]  11 3.5 90 top

## Footprints (pads in the part's own frame, mm; a bottom-side part is the same pattern mirrored in y, then rotated)
C0603
  rect 0.8x0.9 smd: 1(-0.7,0) 2(0.7,0)
C0805
  rect 1.41x1.35 smd: 1(-1,0) 2(1,0)
COMM-TH_LCKFB-TMX-MSPM0G3507
  rect 1.8x1.575 hole 1.1: 1(-19.05,24.09) 41(16.51,-24.09)
  round 1.8 hole 1.1: 2(-16.51,24.09) 3(-19.05,21.549) 4(-16.51,21.549) 5(-19.05,19.009) 6(-16.51,19.009) 7(-19.05,16.47) 8(-16.51,16.47) 9(-19.05,13.93) 10(-16.51,13.93) 11(-19.05,11.389) 12(-16.51,11.389) 13(-19.05,8.85) 14(-16.51,8.85) 15(-19.05,6.309) 16(-16.51,6.309) 17(-19.05,3.769) 18(-16.51,3.769) 19(-19.05,1.23) 20(-16.51,1.23) 21(-19.05,-1.31) 22(-16.51,-1.31) 23(-19.05,-3.85) 24(-16.51,-3.85) 25(-19.05,-6.391) 26(-16.51,-6.391) 27(-19.05,-8.931) 28(-16.51,-8.931) 29(-19.05,-11.47) 30(-16.51,-11.47) 31(-19.05,-14.011) 32(-16.51,-14.011) 33(-19.05,-16.55) 34(-16.51,-16.55) 35(-19.05,-19.09) 36(-16.51,-19.09) 37(-19.05,-21.631) 38(-16.51,-21.631) 39(-19.05,-24.171) 40(-16.51,-24.171) 42(19.05,-24.09) 43(16.51,-21.549) 44(19.05,-21.549) 45(16.51,-19.009) 46(19.05,-19.009) 47(16.51,-16.47) 48(19.05,-16.47) 49(16.51,-13.93) 50(19.05,-13.93) 51(16.51,-11.389) 52(19.05,-11.389) 53(16.51,-8.85) 54(19.05,-8.85) 55(16.51,-6.309) 56(19.05,-6.309) 57(16.51,-3.769) 58(19.05,-3.769) 59(16.51,-1.23) 60(19.05,-1.23) 61(16.51,1.31) 62(19.05,1.31) 63(16.51,3.85) 64(19.05,3.85) 65(16.51,6.391) 66(19.05,6.391) 67(16.51,8.931) 68(19.05,8.931) 69(16.51,11.47) 70(19.05,11.47) 71(16.51,14.011) 72(19.05,14.011) 73(16.51,16.55) 74(19.05,16.55) 75(16.51,19.09) 76(19.05,19.09) 77(16.51,21.631) 78(19.05,21.631) 79(16.51,24.171) 80(19.05,24.171)
HDR-TH_32P-P2.54-V-F-R2-C16-S2.54
  rect 1.6x1.6 hole 1: 1(-19.05,-1.27)
  round 1.6 hole 1: 2(-19.05,1.27) 3(-16.51,-1.27) 4(-16.51,1.27) 5(-13.97,-1.27) 6(-13.97,1.27) 7(-11.43,-1.27) 8(-11.43,1.27) 9(-8.89,-1.27) 10(-8.89,1.27) 11(-6.35,-1.27) 12(-6.35,1.27) 13(-3.81,-1.27) 14(-3.81,1.27) 15(-1.27,-1.27) 16(-1.27,1.27) 17(1.27,-1.27) 18(1.27,1.27) 19(3.81,-1.27) 20(3.81,1.27) 21(6.35,-1.27) 22(6.35,1.27) 23(8.89,-1.27) 24(8.89,1.27) 25(11.43,-1.27) 26(11.43,1.27) 27(13.97,-1.27) 28(13.97,1.27) 29(16.51,-1.27) 30(16.51,1.27) 31(19.05,-1.27) 32(19.05,1.27)
LED0603-RD-YELLOW
  rect 0.8x0.8 smd: 1(-0.799,-0.004) 2(0.799,0.004)
R0603
  rect 0.806x0.864 smd: 1(-0.753,0) 2(0.753,0)
SOT-89-3_L4.5-W2.5-P1.50-LS4.2-BR
  rect 1.575x0.672 smd: 1(1.356,-1.5) 3(1.356,1.5)
  custom 5.377x1.9 smd: 2(-1.356,0)
SW-TH_3P-L8.8-W3.9-P2.50_SS12D00G3
  round 1.524 hole 0.914: 1(-2.5,0) 2(0,0) 3(2.5,0)

## Nets
3V3: C2.2 C4.2 J1.1 J2.2 Q7.2 R1KA12.2 U1.22 U1.38 U1.44 U1.60
5V: U1.24 U1.40 U1.42 U1.58 备用电源开关1.2
5V4: C1.2 C3.2 Q7.3 备用电源开关1.1
AGND: U1.35
GND: C1.1 C2.1 C3.1 C4.1 J1.2 J2.1 J2.3 LED17.1 Q7.1 U1.1 U1.2 U1.21 U1.23 U1.37 U1.39 U1.41 U1.43 U1.54 U1.57 U1.59 U1.79 U1.80 白灯.1 红灯.1 蓝灯.1 黄灯.1
CHIP: U1.36
CLK: U1.20
DIO: U1.19
NRST: J2.5
PA00: J2.10 U1.3
PA01: J2.9 U1.5
PA02: J1.3 U1.61
PA03: J1.4
PA04: J1.5
PA05: J1.6
PA06: J1.7
PA07: J1.10 U1.50
PA08: J1.15 U1.7
PA09: J1.16 U1.9
PA10: J1.17 U1.12
PA11: J1.18 U1.14
PA12: J1.30 U1.29
PA13: J1.31 U1.30
PA14: J1.32 U1.69
PA15: J2.32 U1.70
PA16: J2.31 U1.67
PA17: J2.30 U1.68
PA18: J2.29 U1.46
PA21: J2.25 U1.64
PA22: J2.24 U1.72
PA23: J2.18 U1.62
PA24: J2.17 U1.76
PA25: J2.16 U1.75
PA26: J2.12 U1.78
PA27: J2.11 U1.77
PA28: J2.8 U1.4
PA29: J2.7 U1.34
PA30: J2.6 U1.53
PA31: J2.4 U1.6
PB00: J1.8 U1.51
PB01: J1.9 U1.52
PB02: J1.11 U1.15
PB03: J1.12 U1.17
PB04: J1.13 U1.8
PB05: J1.14 U1.10
PB06: J1.19 U1.25
PB07: J1.20 U1.26
PB08: J1.21 R1kb9.2 U1.27
PB09: J1.22 R1KA10.2 U1.28
PB10: J1.23 U1.49
PB11: J1.24 U1.47
PB12: J1.25 U1.16
PB13: J1.26 U1.18
PB14: J1.27 U1.48
PB15: J1.28 U1.11
PB16: J1.29 U1.13
PB17: J2.28 U1.65
PB18: J2.27 U1.66
PB19: J2.26 U1.63
PB20: J2.23 U1.71
PB21: J2.22 U1.55
PB22: J2.21 U1.56
PB23: J2.20 U1.31
PB24: J2.19 U1.74
PB25: J2.15 U1.73
PB26: J2.14 R1kb8.2 U1.32
PB27: J2.13 R1KA11.2 U1.33
RST: U1.45
$1N1641: R1kb8.1 红灯.2
$1N1642: R1kb9.1 黄灯.2
$1N1643: R1KA10.1 白灯.2
$1N1644: R1KA11.1 蓝灯.2
$1N2178: LED17.2 R1KA12.1

Pads without a net: 备用电源开关1 3

## Via types
v1: diameter 0.61, hole 0.305, Top Layer to Bottom Layer, 96 vias
v2: diameter 0.61, hole 0.5, Top Layer to Bottom Layer, 7 vias
v3: diameter 1, hole 0.8, Top Layer to Bottom Layer, 4 vias

## Routing (per net, layer and track width the routed paths; a pad name or vN(x,y) marks a point on that pad's centre or on a via; arc(x,y) is an arc through that point)
3V3: length 223.4
  Top Layer w0.5: v2(28.91,5.55) v2(30.77,5.55) ; v2(28.91,5.55) Q7.2 17.97,5.55 15.75,7.77 15.75,12.47 v2(13.46,14.75) 6.39,14.75 U1.38 ; v2(28.91,5.55) C4.2 ; v2(30.77,5.55) 32.83,5.55 35.43,2.94 R1KA12.2 ; v2(30.77,5.55) 30.77,7.21 C2.2 ; v2(26.86,66.19) 15.11,66.19 13.59,64.67 13.59,34.91 ; v2(26.86,66.19) 26.92,66.12 26.92,56.41 ; v2(26.86,66.19) v2(47.48,66.19) ; 47.48,34.95 41.82,34.95 U1.60 ; 47.48,34.95 v2(47.48,66.19) ; 47.48,34.95 47.48,14.86 v2(47.24,14.63) ; 13.59,34.91 v2(13.59,20.47) ; 13.59,34.91 U1.22 ; J2.2 55.25,65.3 54.36,66.19 v2(47.48,66.19)
  Bottom Layer w0.5: v2(13.46,14.75) 13.46,16.15 13.59,16.28 v2(13.59,20.47) ; U1.44 41.82,14.63 v2(47.24,14.63)
5V: length 108.4
  Top Layer w0.8: 44.83,9.9 44.83,6.25 45.34,5.74 48.64,5.74 备用电源开关1.2 ; 44.83,9.9 v3(44.83,12.21) ; 44.83,9.9 35.46,9.9 34.8,10.56 34.8,13.61 34.16,14.25 16.64,14.25 11.18,19.71 v3(11.18,20.95) 11.18,31.8 10.61,32.37 U1.24 ; v3(44.83,12.21) 44.79,12.26 41.91,12.26 U1.42 ; v3(44.83,12.21) 46.23,13.61 46.23,31.77 45.59,32.41 41.82,32.41 U1.58
  Bottom Layer w0.8: v3(11.18,20.95) 9.75,20.95 9.02,20.22 9.02,12.09 8.84,11.91 6.36,11.91 U1.40
5V4: length 38.8
  Top Layer w0.8: Q7.3 24.68,7.05 24.76,7.13 24.76,8.79 25.27,9.29 v3(25.54,9.29) ; v3(29.37,9.29) v3(25.54,9.29) ; v3(29.37,9.29) 29.37,11.04 C3.2 ; v3(29.37,9.29) 32.38,9.29 33.91,7.77 42.51,7.77 43.31,6.97 43.31,4.47 44.7,3.07 48.73,3.07 备用电源开关1.1 ; v3(25.54,9.29) 25.54,10.17 24.51,11.2 C1.2
PA00: length 93
  Top Layer w0.3: v1(6.6,67.71) 6.86,67.97 59.06,67.97 61.21,65.81 61.21,47.39 60.07,46.25 J2.10
  Bottom Layer w0.3: U1.3 2.03,59.42 2.03,63.14 v1(6.6,67.71)
PA01: length 107
  Top Layer w0.3: v1(5.97,68.6) 61.21,68.6 62.99,66.82 62.99,46.12 61.85,44.98 53.97,44.98 J2.9
  Bottom Layer w0.3: U1.5 1.95,55.23 1.4,55.78 1.4,64.03 v1(5.97,68.6)
PA02: length 27
  Top Layer w0.3: 26.92,53.87 28.19,52.6 32.77,52.6 35.05,50.31 35.05,37.74 35.97,36.82 38.54,36.82 U1.61
PA07: length 33.5
  Top Layer w0.3: U1.50 40.58,23.49 36.35,23.49 33.88,25.96 33.88,45.14 32.77,46.25 J1.10
PA08: length 35
  Top Layer w0.3: v1(11.43,51.2) 11.28,51.35 5.02,51.35 U1.7 ; v1(15.11,50.31) 15.37,50.06 15.37,39.9 16.64,38.63 26.92,38.63
  Bottom Layer w0.3: v1(11.43,51.2) 14.22,51.2 v1(15.11,50.31)
PA09: length 37.1
  Top Layer w0.3: v1(8.64,46) 8.64,48.28 8.11,48.81 5.02,48.81 U1.9 ; v1(17.53,37.36) 28.19,37.36 J1.16
  Bottom Layer w0.3: v1(17.53,37.36) 10.16,37.36 9.02,38.5 9.02,45.62 v1(8.64,46)
PA10: length 31.1
  Top Layer w0.3: 26.92,36.09 16.89,36.09 14.6,38.38 v1(14.6,47.65)
  Bottom Layer w0.3: U1.12 6.52,47.9 14.35,47.9 v1(14.6,47.65)
PA11: length 31.1
  Top Layer w0.3: v1(16,35.46) 16.64,34.82 28.19,34.82 J1.18
  Bottom Layer w0.3: v1(16,35.46) 14.99,36.47 9.53,36.47 8.25,37.74 8.25,43.04 U1.14
PA12: length 28.4
  Top Layer w0.3: v1(14.73,21.36) 16.51,19.58 28.19,19.58 J1.30
  Bottom Layer w0.3: v1(14.73,21.36) 12.68,23.41 5.19,23.41 3.85,24.75 U1.29
PA13: length 25.7
  Top Layer w0.3: 26.92,18.31 14.48,18.31 12.57,20.22 12.57,24.15 v1(12.32,24.41)
  Bottom Layer w0.3: v1(12.32,24.41) 11.98,24.75 U1.30
PA14: length 42.8
  Top Layer w0.3: U1.69 39.16,47.77 37.85,47.77 36.8,46.73 36.8,37.9 v1(36.83,37.87) ; J1.32 33.27,18.31 v1(34.42,19.45) ; v1(35.56,29.36) 36.7,30.5 v1(36.7,35.58)
  Bottom Layer w0.3: v1(34.42,19.45) 36.58,21.61 36.58,23.9 36.32,24.15 34.16,24.15 32.38,25.93 32.38,28.6 33.15,29.36 v1(35.56,29.36) ; v1(36.83,37.87) 36.7,37.74 v1(36.7,35.58)
PA15: length 99
  Top Layer w0.3: v1(43.18,62) 46.23,62 v1(46.48,61.74) ; U1.70 40.55,48.92 v1(36.96,48.92) ; v1(59.06,38.04) 58.8,37.78 58.8,36.34 57.15,34.69 51.18,34.69 49.15,32.66 49.15,22.25 v1(49.4,21.99)
  Bottom Layer w0.3: v1(36.96,48.92) 35.94,49.93 35.94,61.24 36.96,62.25 42.93,62.25 v1(43.18,62) ; v1(59.06,38.04) 59.06,38.12 59.08,38.15 60.07,38.15 60.08,38.16 60.88,38.16 61.09,38.38 61.09,57.55 56.9,61.74 v1(46.48,61.74) ; v1(49.4,21.99) 50.16,21.99 50.55,21.61 50.55,20.09 51.18,19.45 54.1,19.45 J2.32
PA16: length 117.9
  Top Layer w0.3: v1(45.47,64.16) 37.59,64.16 v1(35.81,62.38) ; J2.31 52.71,16.53 51.69,15.52 48.64,15.52 48.39,15.77 48.39,20.95 48.69,21.25 50.06,21.25 51.05,22.25 v1(51.05,25.55) ; v1(56.77,37.11) 58.04,37.11 v1(58.17,37.23) ; v1(57.28,32.92) 57.28,33.8 v1(57.66,34.19)
  Bottom Layer w0.3: v1(57.66,34.19) 56.51,35.33 56.51,36.85 v1(56.77,37.11) ; v1(51.05,25.55) 51.05,28.98 51.69,29.61 56.77,29.61 58.17,31.01 58.17,32.03 v1(57.28,32.92) ; v1(58.17,37.23) 61.34,37.23 62.36,38.25 62.36,41.55 63.5,42.69 63.5,44.73 62.87,45.36 62.87,62.76 61.47,64.16 v1(45.47,64.16) ; v1(35.81,62.38) 35.5,62.06 35.5,46.06 37.34,44.22 38.31,44.22 U1.67
PA17: length 47
  Top Layer w0.3: v1(44.96,20.09) 44.96,30.12 44.32,30.76 v1(44.32,31.01) ; v1(44.2,36.09) 45.34,37.23 45.34,38.63 43.81,40.15 43.81,44.73 43.39,45.15 U1.68
  Bottom Layer w0.3: v1(44.2,36.09) 44.2,31.14 v1(44.32,31.01) ; J2.30 56.13,20.85 56.9,20.09 56.9,16.79 56.64,16.53 52.2,16.53 49.78,18.95 46.1,18.95 v1(44.96,20.09)
PA18: length 13.9
  Top Layer w0.3: v1(44.96,17.42) 42,17.42 U1.46 ; J2.29 52.41,20.55 49.58,20.55 49.28,20.25 49.28,17.68 v1(49.02,17.42)
  Bottom Layer w0.3: v1(49.02,17.42) v1(44.96,17.42)
PA21: length 48.2
  Top Layer w0.3: v1(62.48,25.04) 64.26,26.82 64.26,35.07 v1(64.13,35.2)
  Bottom Layer w0.3: v1(62.48,25.04) 62.1,24.66 53.97,24.66 J2.25 ; v1(64.13,35.2) 60.32,35.2 60.11,34.99 57.73,34.99 57.52,35.2 57.52,39.03 56.64,39.9 41.95,39.9 U1.64
PA22: length 43.9
  Top Layer w0.3: v1(62.36,32.66) 62.36,41.42 61.85,41.93 57.66,41.93 v1(57.28,42.31) ; v1(59.06,29.74) 57.78,28.47 J2.24
  Bottom Layer w0.3: v1(59.06,29.74) 60.45,31.14 61.98,31.14 62.36,31.52 v1(62.36,32.66) ; v1(57.28,42.31) 51.44,42.31 50.93,42.82 50.93,45.27 49.48,46.72 45.89,46.72 42.38,50.23 U1.72
PA23: length 15.3
  Bottom Layer w0.3: U1.62 42.59,36.73 47.5,36.73 49.4,34.82 54.36,34.82 55.25,35.71 J2.18
PA24: length 28.1
  Top Layer w0.3: J2.17 49.48,36.09 49.18,36.39 49.18,46.98 v1(48.26,47.9)
  Bottom Layer w0.3: U1.76 43.13,55.31 43.43,55.01 43.43,49.93 44.96,48.41 47.75,48.41 v1(48.26,47.9)
PA25: length 35.6
  Top Layer w0.3: v1(37.63,45.23) 37.63,39.1 37.85,38.88 38.73,38.88 38.75,38.87 42.28,38.87 42.3,38.88 43.69,38.88 v1(44.58,38) ; J2.16 54.1,37.49 v1(50.42,37.49)
  Bottom Layer w0.3: v1(44.58,38) 45.09,37.49 v1(50.42,37.49) ; U1.75 37.63,53.7 v1(37.63,45.23)
PA26: length 28.9
  Top Layer w0.3: v1(45.34,42.44) 45.34,56.54 44.03,57.85 U1.78 ; J2.12 53.97,42.44 v1(49.78,42.44)
  Bottom Layer w0.3: v1(49.78,42.44) 49.41,42.07 45.71,42.07 v1(45.34,42.44)
PA27: length 26.1
  Top Layer w0.3: U1.77 40.44,56.65 43.58,56.65 44.7,55.52 v1(44.7,43.96) ; J2.11 v1(50.04,43.71)
  Bottom Layer w0.3: v1(44.7,43.96) 44.96,43.71 v1(50.04,43.71)
PA28: length 82.4
  Top Layer w0.3: J2.8 58.29,48.79 59.06,49.55 59.06,65.81 57.91,66.95 8.94,66.95 8.64,66.65 8.64,58.32 8.09,57.77 U1.4
PA29: length 134.7
  Top Layer w0.3: J2.7 53.97,47.52 58.8,47.52 59.82,48.54 59.82,66.32 58.67,67.46 8.13,67.46 6.22,65.55 1.78,65.55 1.27,65.05 1.27,22.25 2.51,21.01 4.89,21.01 U1.34
PA30: length 37.4
  Top Layer w0.3: v1(48.51,49.93) 53.85,49.93 J2.6 ; v1(46.1,49.55) v1(46.1,35.96)
  Bottom Layer w0.3: v1(48.51,49.93) 46.48,49.93 v1(46.1,49.55) ; U1.53 39.24,27.58 40.39,28.72 41.27,28.72 41.28,28.71 42.28,28.71 42.3,28.72 44.58,28.72 45.47,29.61 45.47,35.33 v1(46.1,35.96)
PA31: length 65.4
  Top Layer w0.3: v1(49.02,52.6) 53.97,52.6 J2.4
  Bottom Layer w0.3: U1.6 8.39,55.23 8.76,55.6 8.76,61.74 10.54,63.52 43.69,63.52 44.7,62.51 44.7,55.23 44.92,55.01 46.61,55.01 v1(49.02,52.6)
PB00: length 32.2
  Top Layer w0.3: J1.8 33.27,48.79 34.54,47.52 34.54,26.18 35.81,24.91 39.16,24.91 U1.51
PB01: length 33.7
  Top Layer w0.3: 26.92,46.25 28.19,44.98 32.59,44.98 32.89,44.68 32.89,27.58 v1(33.15,27.33)
  Bottom Layer w0.3: v1(33.15,27.33) 34.42,26.06 40.55,26.06 U1.52
PB02: length 23.8
  Top Layer w0.3: v1(11.68,43.84) 4.99,43.84 U1.15 ; 26.92,43.71 v1(16.76,43.71)
  Bottom Layer w0.3: v1(11.68,43.84) 16.64,43.84 v1(16.76,43.71)
PB03: length 27.3
  Top Layer w0.3: v1(16.89,42.44) 28.19,42.44 J1.12 ; v1(11.43,41.93) 10.79,41.3 4.99,41.3 U1.17
  Bottom Layer w0.3: v1(16.89,42.44) 11.94,42.44 v1(11.43,41.93)
PB04: length 31.4
  Top Layer w0.3: v1(15.24,52.22) 15.88,51.58 15.88,41.42 16.13,41.17 26.92,41.17 ; v1(11.56,52.35) 6.56,52.35 U1.8
  Bottom Layer w0.3: v1(11.56,52.35) 15.11,52.35 v1(15.24,52.22)
PB05: length 33.2
  Top Layer w0.3: J1.14 28.19,39.9 v1(17.4,39.9) ; U1.10 9.69,50.15 10.41,49.43 v1(10.41,45.49)
  Bottom Layer w0.3: v1(10.41,45.49) 10.41,40.54 11.05,39.9 v1(17.4,39.9)
PB06: length 25.5
  Top Layer w0.3: v1(15.62,33.3) 15.88,33.55 26.92,33.55
  Bottom Layer w0.3: U1.25 4.99,31.14 14.73,31.14 15.62,32.03 v1(15.62,33.3)
PB07: length 25.5
  Top Layer w0.3: J1.20 28.32,32.41 16.76,32.41 15.88,31.52 15.88,30.25 v1(15.62,29.99)
  Bottom Layer w0.3: U1.26 6.39,29.99 v1(15.62,29.99)
PB08: length 51.2
  Top Layer w0.3: R1kb9.2 11.05,10.69 v1(11.43,11.07) ; v1(17.15,22.12) 15.75,23.52 15.75,26.18 15.52,26.41 15.52,27.74 15.75,27.96 v1(15.75,28.72) 16.38,28.72 17.02,29.36 17.02,30.38 17.65,31.01 26.92,31.01
  Bottom Layer w0.3: U1.27 5.02,28.63 15.65,28.63 v1(15.75,28.72) ; v1(17.15,22.12) 17.15,12.98 15.24,11.07 v1(11.43,11.07)
PB09: length 45
  Top Layer w0.3: R1KA10.2 14.1,11.96 v1(14.22,12.09) ; v1(16.13,27.33) 16.38,27.33 17.53,28.47 17.53,29.36 17.91,29.74 28.19,29.74 J1.22
  Bottom Layer w0.3: U1.28 16.09,27.29 v1(16.13,27.33) 16.13,13.99 v1(14.22,12.09)
PB10: length 14.9
  Top Layer w0.3: 26.92,28.47 28.32,27.07 31.62,27.07 36.41,22.29 U1.49
PB11: length 15.5
  Top Layer w0.3: v1(31.62,28.34) 31.5,28.47 J1.24 ; U1.47 38.06,19.75 33.4,24.41 v1(32,24.41)
  Bottom Layer w0.3: v1(32,24.41) 31.7,24.71 31.7,28.26 v1(31.62,28.34)
PB12: length 38.5
  Top Layer w0.3: 26.92,25.93 18.16,25.93 v1(17.91,26.18) ; v1(12.7,41.3) 12.7,42.57 12.32,42.95 6.64,42.95 U1.16
  Bottom Layer w0.3: v1(17.91,26.18) 17.91,34.57 19.18,35.84 19.18,39.9 18.03,41.04 12.95,41.04 v1(12.7,41.3)
PB13: length 40.2
  Top Layer w0.3: v1(17.02,24.91) 17.27,24.66 28.19,24.66 J1.26 ; v1(10.67,39.01) 9.69,39.99 U1.18
  Bottom Layer w0.3: v1(17.02,24.91) 17.02,35.46 18.54,36.98 18.54,38.38 18.33,38.59 11.09,38.59 v1(10.67,39.01)
PB14: length 17.6
  Top Layer w0.3: 26.92,23.39 28.07,22.25 33.4,22.25 37.09,18.56 38.73,18.56 38.75,18.55 39.74,18.55 39.75,18.56 41.02,18.56 41.78,19.32 U1.48
PB15: length 47.7
  Bottom Layer w0.3: J1.28 28.19,24.66 20.07,24.66 18.54,26.18 18.54,34.63 19.58,35.67 19.58,40.26 17.53,42.31 17.53,45.36 16.13,46.76 7.62,46.76 7.24,46.38 4.83,46.38 3.68,47.52 U1.11
PB16: length 48.7
  Top Layer w0.3: v1(14.6,35.58) 14.86,35.33 14.86,22.88 16.89,20.85 26.92,20.85
  Bottom Layer w0.3: v1(14.6,35.58) 8.25,35.58 7.59,36.25 2.3,36.25 2,36.55 2,44.77 2.3,45.07 U1.13
PB17: length 59.6
  Top Layer w0.3: v1(36.07,42.57) 35.69,42.19 v1(35.69,40.03)
  Bottom Layer w0.3: v1(35.69,40.03) 35.05,39.39 32,39.39 31.54,38.93 31.54,29.12 31.02,28.6 31.02,24.25 31.54,23.73 31.54,18.27 31.75,18.06 34.23,18.06 37.08,20.91 38.71,20.91 38.75,20.95 42.28,20.95 42.32,20.91 43.24,20.91 43.81,21.49 43.81,23.01 45.47,24.66 53.34,24.66 54.61,23.39 J2.28 ; v1(36.07,42.57) 39.2,42.57 U1.65
PB18: length 60.6
  Top Layer w0.3: v1(62.74,30.12) 62.74,30.63 62.99,30.88 62.99,42.06 61.85,43.2 v1(58.04,43.2) ; v1(50.93,47.9) 50.16,47.9 49.91,47.65 v1(49.91,45.11)
  Bottom Layer w0.3: U1.66 43.09,42.61 43.73,43.24 43.73,44.77 43.94,44.98 49.78,44.98 v1(49.91,45.11) ; J2.27 53.97,22.12 62.36,22.12 63.37,23.14 63.37,28.6 62.74,29.23 v1(62.74,30.12) ; v1(50.93,47.9) 51.23,47.6 51.23,45.7 51.94,44.98 56.9,44.98 57.28,44.6 57.28,43.96 v1(58.04,43.2)
PB19: length 38.9
  Top Layer w0.3: v1(48.51,33.42) 48.51,41.04 v1(48.39,41.17) ; v1(57.28,31.26) 57.94,30.6 59.43,30.6 59.79,30.25 59.79,29.39 60.07,29.11 60.07,26.82 v1(59.44,26.18)
  Bottom Layer w0.3: v1(59.44,26.18) 59.18,25.93 J2.26 ; U1.63 40.44,41.27 48.29,41.27 v1(48.39,41.17) ; v1(48.51,33.42) 48.64,33.42 49.66,32.41 56.26,32.41 57.28,31.39 v1(57.28,31.26)
PB20: length 85.1
  Top Layer w0.3: U1.71 37.93,50.23 v1(36.96,51.2) ; v1(36.7,53.62) 36.7,61.24 38.23,62.76 v1(45.85,62.76) ; v1(62.48,27.2) 62.87,27.2 63.53,27.86 63.53,43.43 63.12,43.84 62.87,43.84 v1(62.48,44.22)
  Bottom Layer w0.3: v1(45.85,62.76) 60.32,62.76 62.18,60.9 62.18,44.52 v1(62.48,44.22) ; v1(62.48,27.2) 53.97,27.2 J2.23 ; v1(36.96,51.2) 36.7,51.46 v1(36.7,53.62)
PB21: length 26.1
  Top Layer w0.3: U1.55 37.89,29.91 37.34,29.36 37.34,26.48 37.79,26.03 42.15,26.03 42.3,26.18 v1(44.32,26.18) ; J2.22 53.85,29.61 50.93,29.61 50.16,28.85 v1(50.16,27.33)
  Bottom Layer w0.3: v1(50.16,27.33) 49.02,26.18 v1(44.32,26.18)
PB22: length 14.3
  Top Layer w0.3: v1(43.94,27.84) 43.94,29.49 43.52,29.91 U1.56
  Bottom Layer w0.3: J2.21 50.04,31.01 46.61,27.58 44.2,27.58 v1(43.94,27.84)
PB23: length 122.4
  Bottom Layer w0.3: U1.31 3.45,22.44 1.46,22.44 0.64,21.61 0.64,6.12 5.08,1.67 60.96,1.67 64.01,4.72 64.01,32.41 62.87,33.55 J2.20
PB24: length 53.8
  Top Layer w0.3: v1(59.82,38.76) 59.82,34.31 57.78,32.28 53.97,32.28 J2.19
  Bottom Layer w0.3: v1(59.82,38.76) 59.82,51.2 58.55,52.47 51.44,52.47 50.42,51.46 44.5,51.46 44.2,51.76 44.2,55.39 43.08,56.51 40.99,56.51 40.58,56.1 40.58,53.97 U1.74
PB25: length 32.6
  Top Layer w0.3: v1(35.81,43.71) 35.81,51.58 36.7,52.47 38.95,52.47 U1.73 ; J2.15 v1(50.04,38.63)
  Bottom Layer w0.3: v1(50.04,38.63) 42.38,38.63 42.28,38.73 38.38,38.73 35.31,41.81 35.31,43.2 v1(35.81,43.71)
PB26: length 137.8
  Top Layer w0.3: v1(1.4,16.91) 1.4,3.71 4.19,0.91 60.32,0.91 61.72,2.31 v1(61.72,12.13) 61.72,40.79 61.34,41.17 J2.14 ; v1(55.37,11.83) 55.25,11.71 R1kb8.2
  Bottom Layer w0.3: U1.32 6.22,22.12 5.08,20.98 1.78,20.98 1.4,20.6 v1(1.4,16.91) ; v1(61.72,12.13) 55.67,12.13 v1(55.37,11.83)
PB27: length 125.8
  Top Layer w0.3: v1(60.83,11.45) 60.83,3.45 59.18,1.8 3.94,1.8 2.03,3.71 2.03,19.2 2.5,19.67 U1.33 ; v1(60.83,11.45) 58.8,11.45 58.67,11.33 58.67,10.19 R1KA11.2 ; v1(60.83,11.45) 60.83,39.39 60.32,39.9 53.97,39.9 J2.13
$1N1641: length 3
  Top Layer w0.3: 红灯.2 55.25,5.65 R1kb8.1
$1N1642: length 2.6
  Top Layer w0.3: 黄灯.2 11.05,4.35 R1kb9.1
$1N1643: length 2.6
  Top Layer w0.3: R1KA10.1 14.1,4.38 白灯.2
$1N1644: length 2.9
  Top Layer w0.3: 蓝灯.2 58.93,5.91 58.93,7.13 58.67,7.4 R1KA11.1
$1N2178: length 2.3
  Top Layer w0.5: R1KA12.1 37.96,3.07 40.09,3.07
